# EAGLE board xio (EAGLE 9.1.0), part 1 of 4
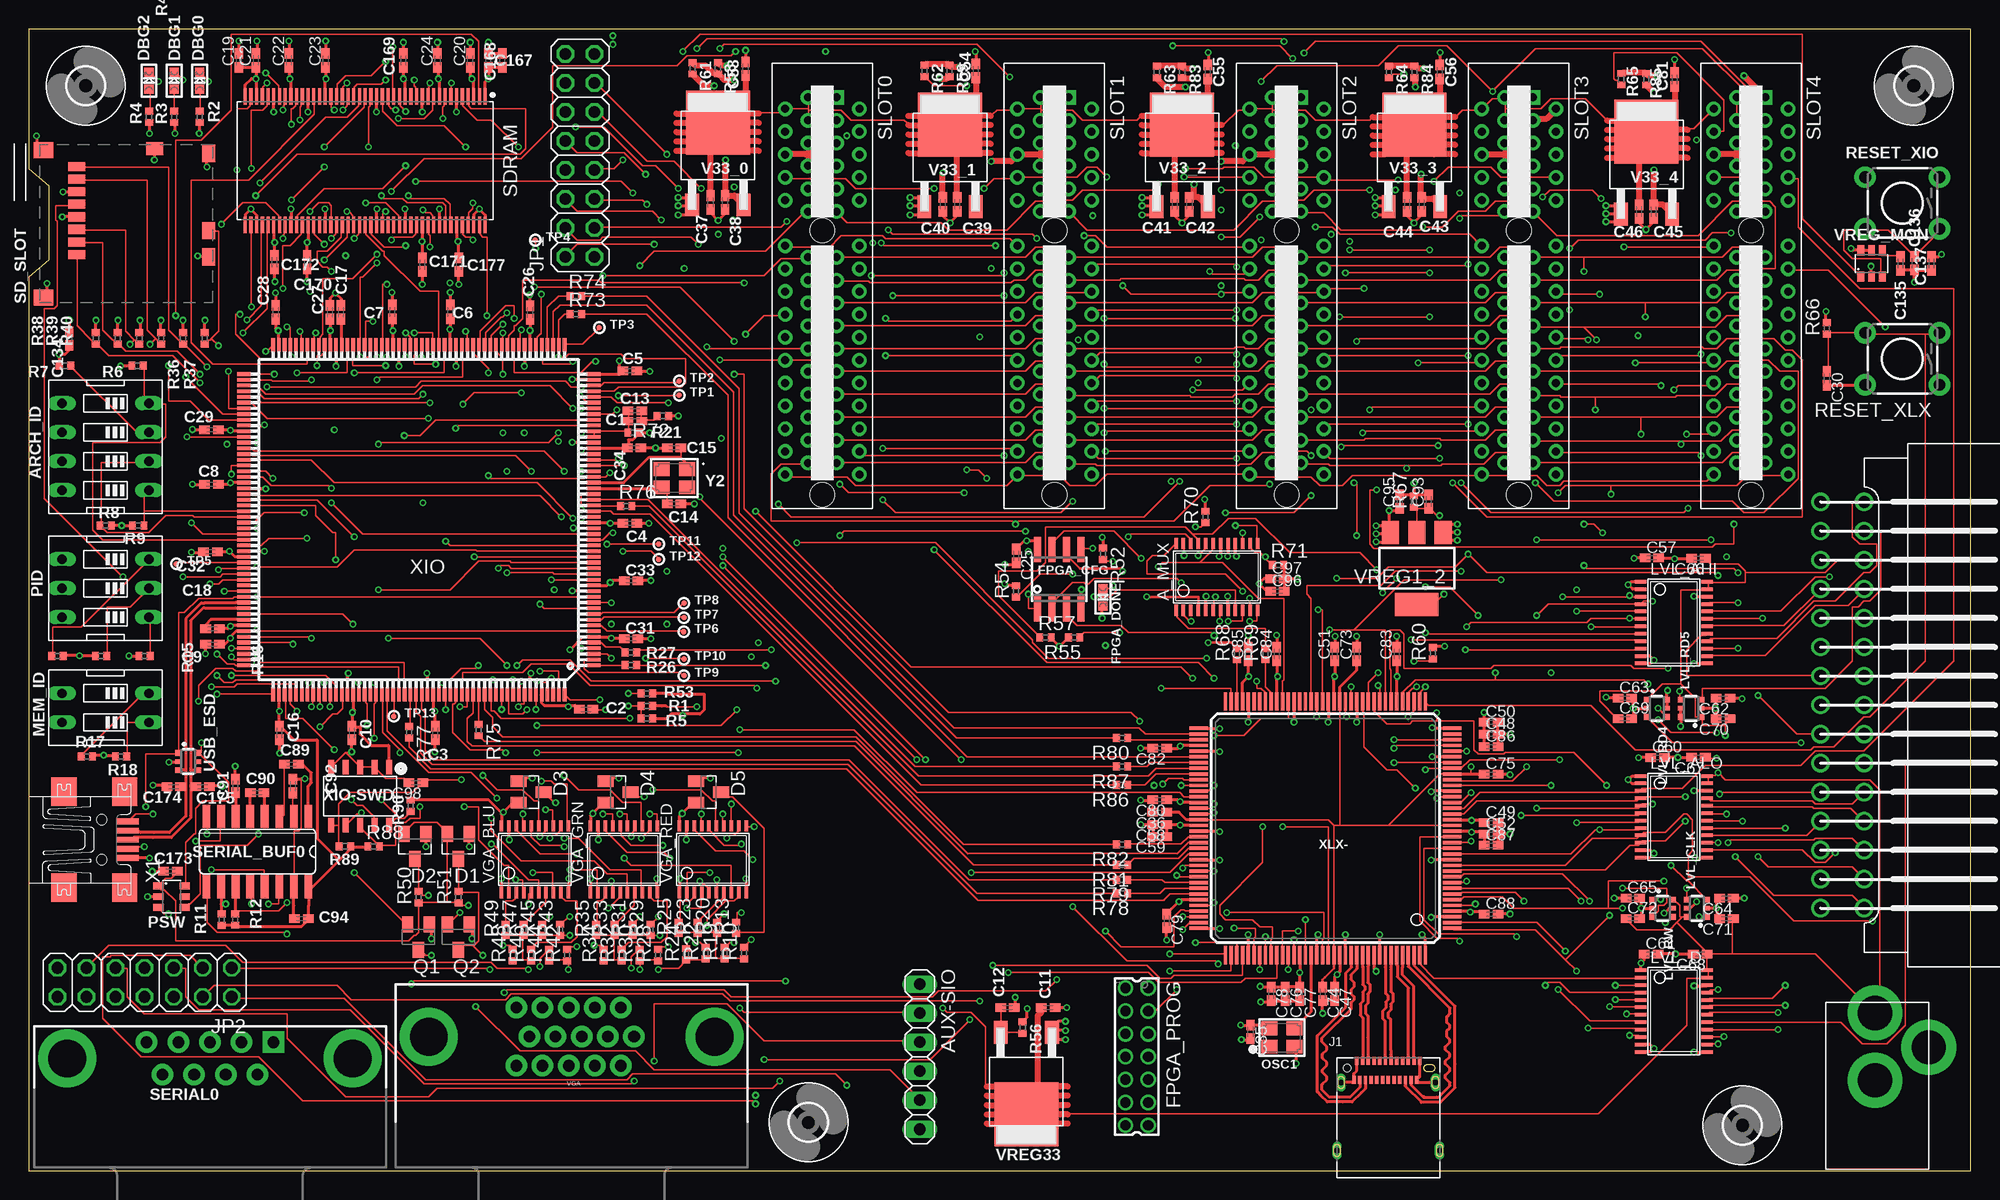
[diagram p19: board, top side]
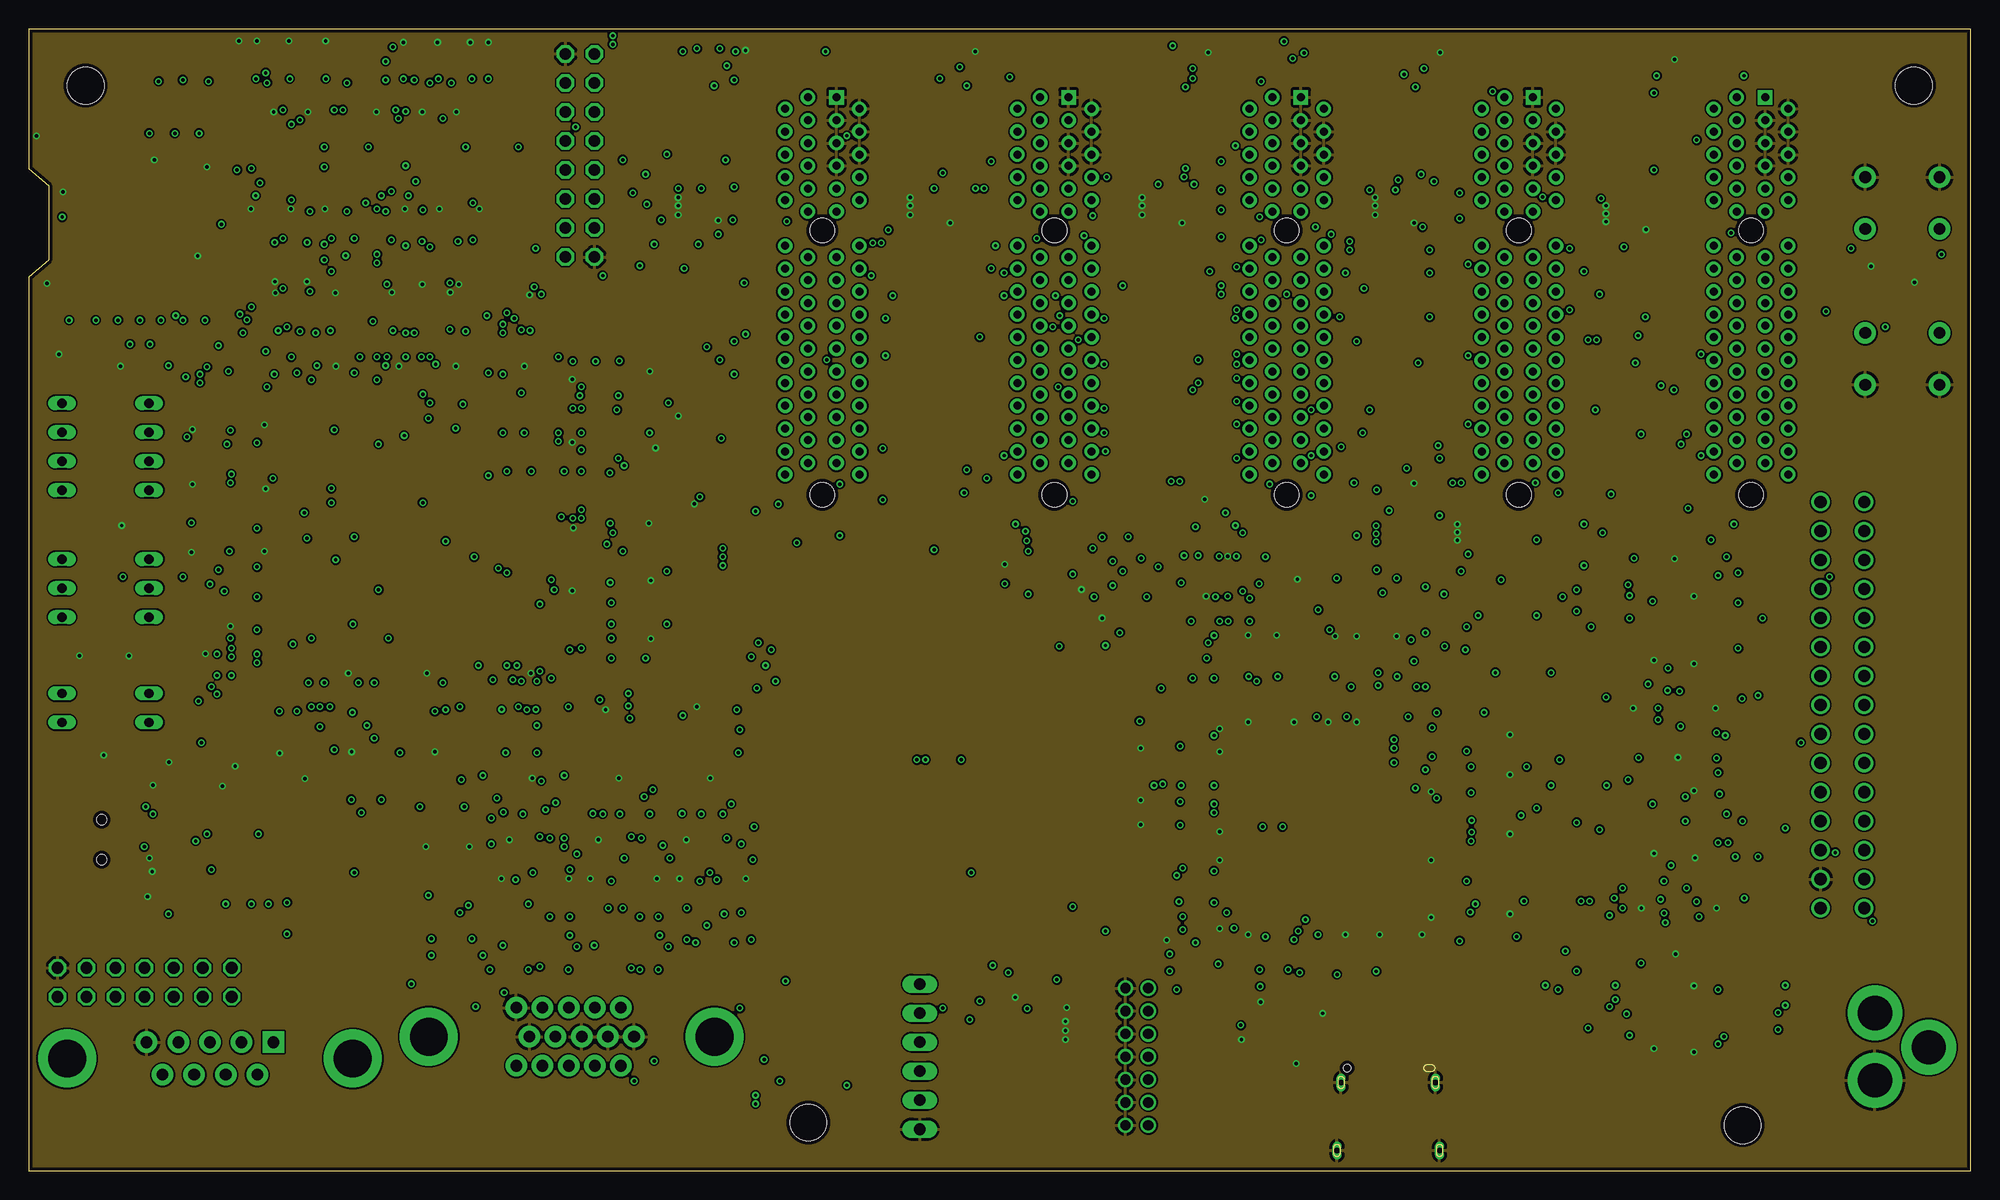
[diagram p20: board, inner layer Route2]
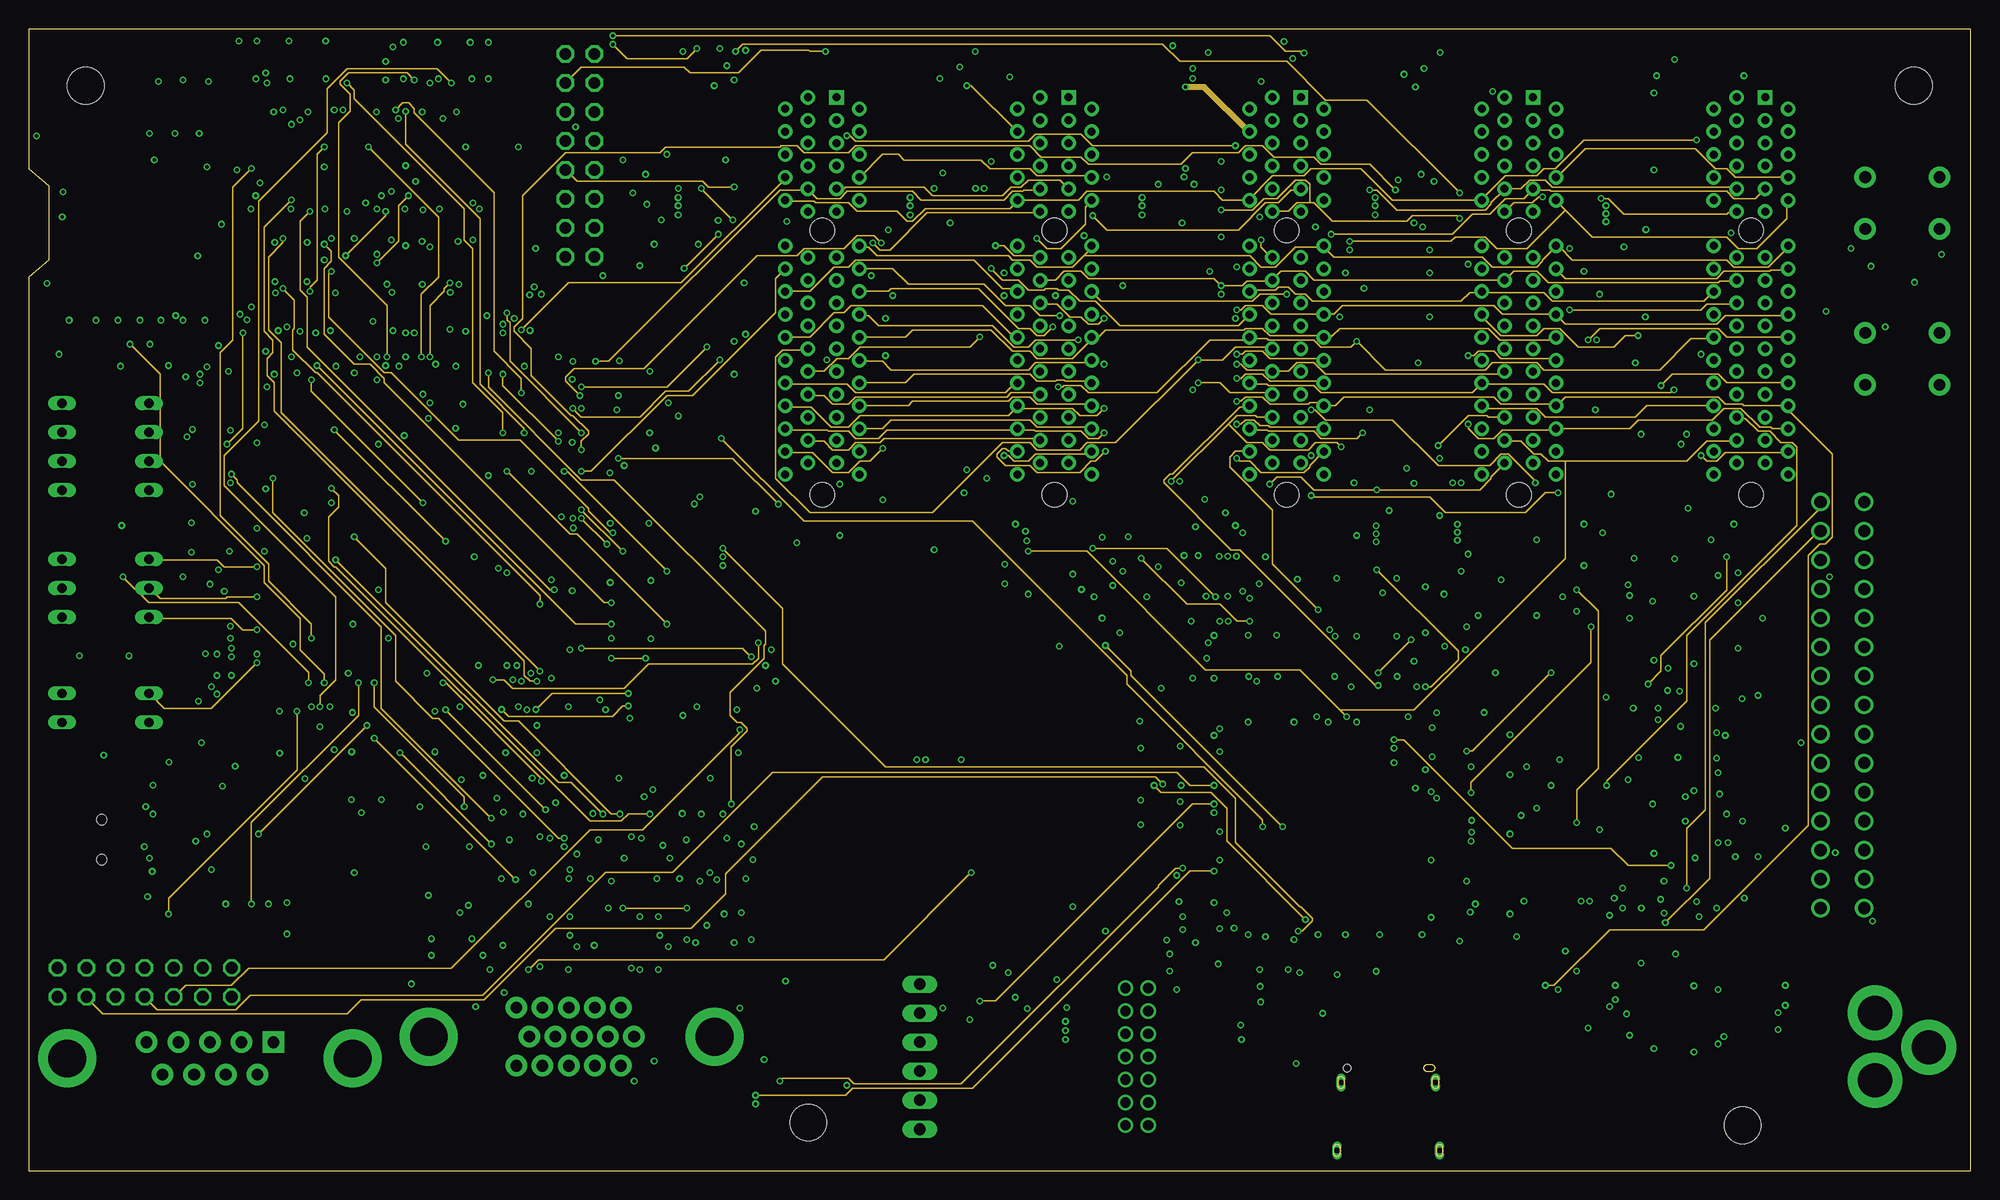
[diagram p21: board, inner layer Route3]
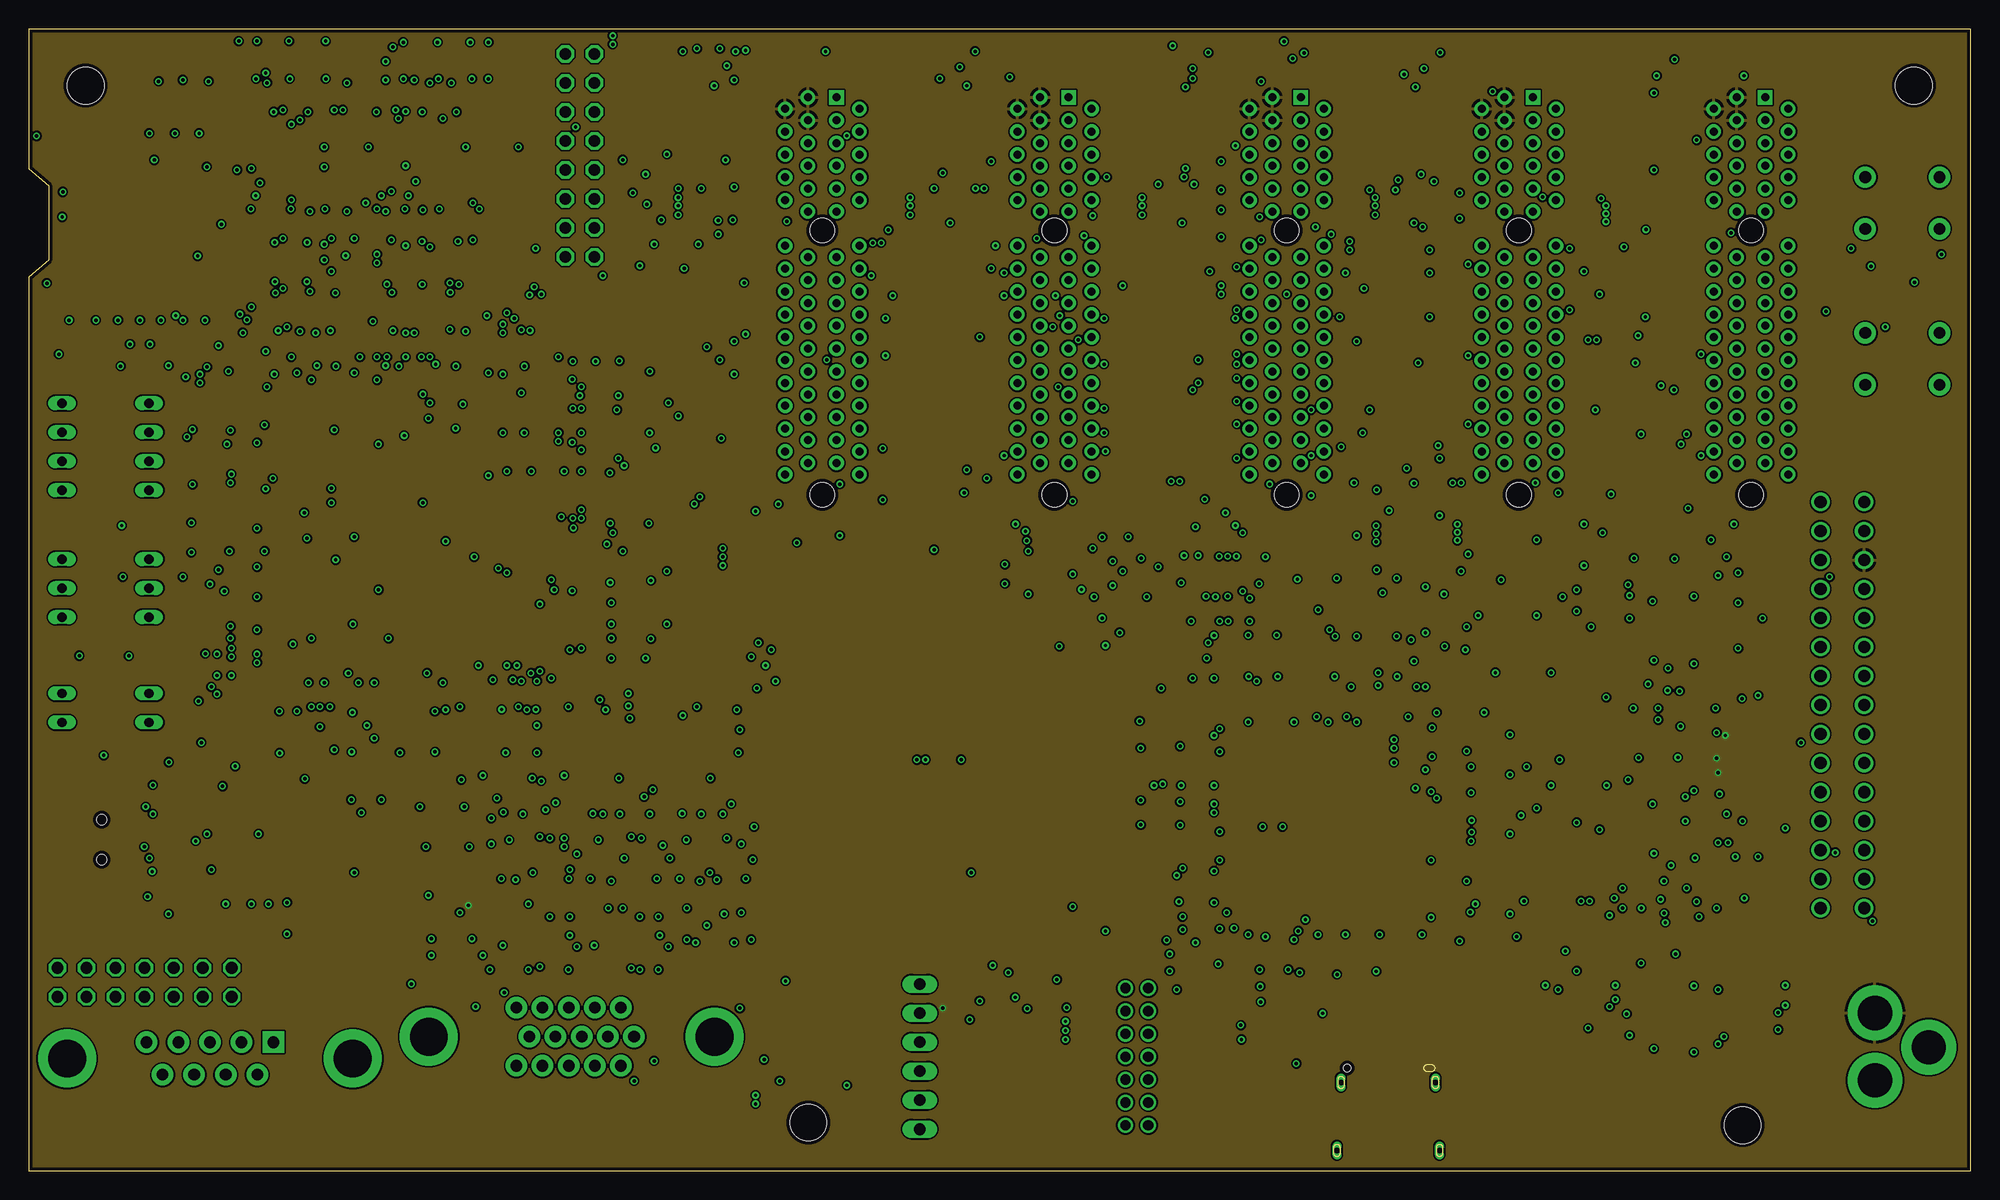
[diagram p22: board, inner layer Route14]
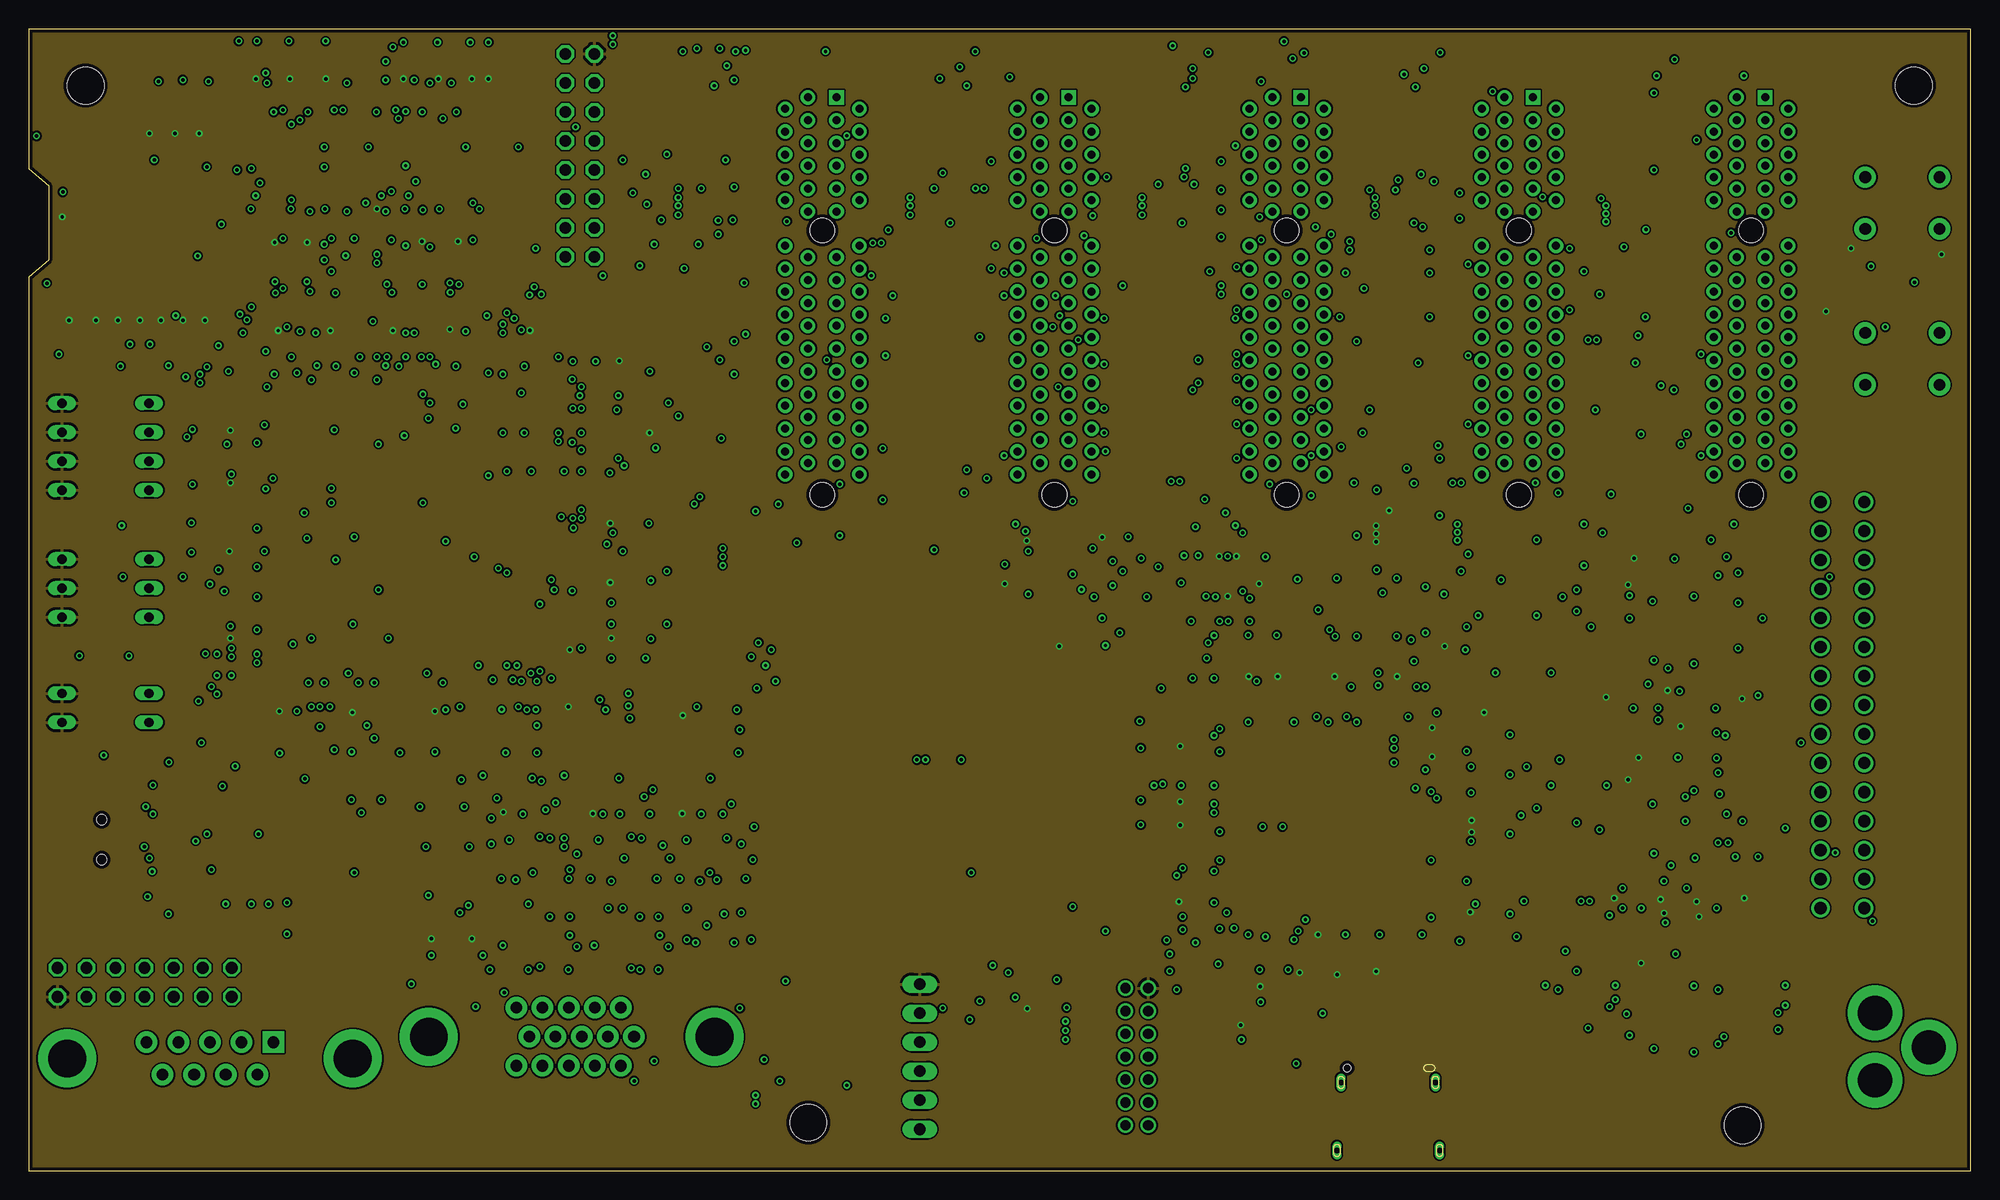
[diagram p23: board, inner layer Route15]
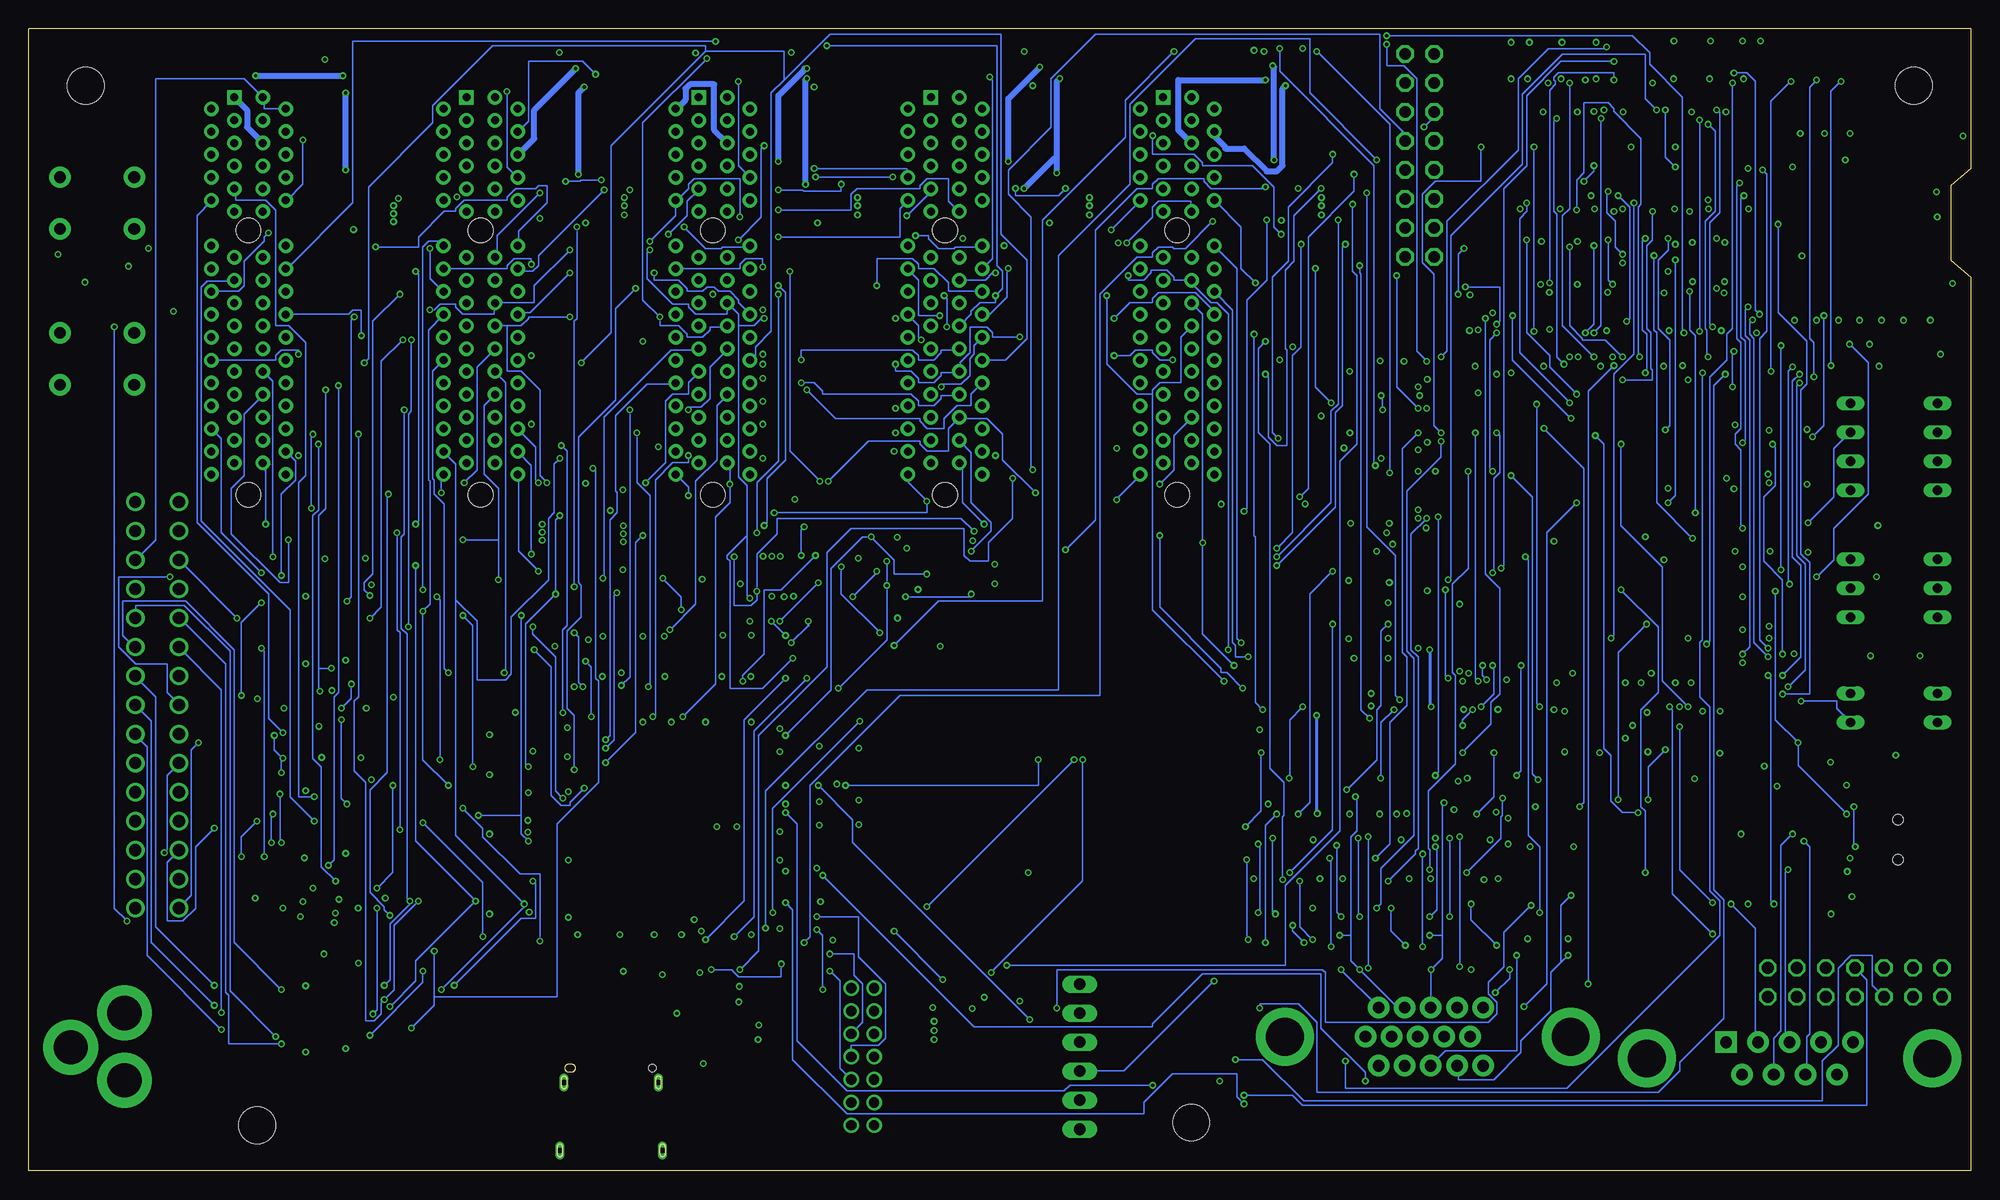
[diagram p24: board, bottom side, seen from below]

Size 170 x 100 mm. Coordinates in mm from the lower left corner, seen from the top.
Outline: 170,0 170,100 24,100 23,100 15,100 14,100 13,100 0,100 0,87.75 1.75,86.25 1.75,79.75 0,78.25 0,0 123.89,0 153.03,0 170,0
Copper layers (1+2*3+14*15+16): Top 0.035mm / dielectric 0.12mm / Route2 0.017mm / dielectric 0.5mm / Route3 0.017mm / dielectric 0.24mm / Route14 0.017mm / dielectric 0.5mm / Route15 0.017mm / dielectric 0.12mm / Bottom 0.035mm
Design rules "seed-4layer-6.6 *": minimum track width 6mil, minimum drill 0.3mm, track to track 6mil, track to pad 6mil, pad to pad 6mil, via to via 6mil, smd to smd 0mil, copper to edge 12mil, drill to drill 12mil, minimum pad ring 6mil, minimum via ring 5.5mil, stop-mask expansion 4mil, vias tented up to drill 25mil, thermal gap 10mil
Net classes: 1 Power: width 0.305 mm, drill 0.203 mm; 2 Slot-power: width 0.508 mm; 3 tx100: width 0.254 mm, clearance 0.457 mm; 4 usb90: width 0.254 mm, clearance 0.178 mm; 5 cclk50: width 0.203 mm; 6 3v3: width 0.254 mm

## Footprints (pad centres in the part's own frame; a part is rotated, then mirrored left to right if it is on the bottom)
TSSOP24 = smd 0.305 x 0.991: 1 -3.575,-2.918; 2 -2.925,-2.918; 3 -2.275,-2.918; 4 -1.625,-2.918; 5 -0.975,-2.918; 6 -0.325,-2.918; 7 0.325,-2.918; 8 0.975,-2.918; 9 1.625,-2.918; 10 2.275,-2.918; 11 2.925,-2.918; 12 3.575,-2.918; 13 3.575,2.918; 14 2.925,2.918; 15 2.275,2.918; 16 1.625,2.918; 17 0.975,2.918; 18 0.325,2.918; 19 -0.325,2.918; 20 -0.975,2.918; 21 -1.625,2.918; 22 -2.275,2.918; 23 -2.925,2.918; 24 -3.575,2.918
EDG-04 = drill 0.813 long: 1 -3.81,-3.81; 2 -1.27,-3.81; 3 1.27,-3.81; 4 3.81,-3.81; 5 3.81,3.81; 6 1.27,3.81; 7 -1.27,3.81; 8 -3.81,3.81
1X06 = drill 1.016 long: 1 -6.35,0; 2 -3.81,0; 3 -1.27,0; 4 1.27,0; 5 3.81,0; 6 6.35,0
C0402K = smd 0.925 x 0.74: 1 -0.6,0; 2 0.6,0
A8_CART = drill 1.067: P1 -17.78,6.35; P2 -15.24,6.35; P3 -12.7,6.35; P4 -10.16,6.35; P5 -7.62,6.35; P6 -5.08,6.35; P7 -2.54,6.35; P8 0,6.35; P9 2.54,6.35; P10 5.08,6.35; P11 7.62,6.35; P12 10.16,6.35; P13 12.7,6.35; P14 15.24,6.35; P15 17.78,6.35; PA -17.78,10.16; PB -15.24,10.16; PC -12.7,10.16; PD -10.16,10.16; PE -7.62,10.16; PF -5.08,10.16; PH -2.54,10.16; PJ 0,10.16; PK 2.54,10.16; PL 5.08,10.16; PM 7.62,10.16; PN 10.16,10.16; PP 12.7,10.16; PR 15.24,10.16; PS 17.78,10.16
SOT23 = smd 1 x 1.4: 1 -0.95,-1.1; 2 0.95,-1.1; 3 0,1.1
CHIPLED_0603 = smd 0.8 x 0.8: A 0,-0.75; C 0,0.75
SOIC8_150MIL = smd 0.6 x 2.2: 1 -1.905,-2.6; 2 -0.635,-2.6; 3 0.635,-2.6; 4 1.905,-2.6; 5 1.905,2.6; 6 0.635,2.6; 7 -0.635,2.6; 8 -1.905,2.6
332-14 = drill 0.9 pad 1.27: 1 -6,-1; 2 -6,1; 3 -4,-1; 4 -4,1; 5 -2,-1; 6 -2,1; 7 0,-1; 8 0,1; 9 2,-1; 10 2,1; 11 4,-1; 12 4,1; 13 6,-1; 14 6,1
3,2 = hole 3.2: 0,0
AMPHENOL_12401598E4#2A = smd 0.3 x 0.7: A1 -2.75,0.66; A2 -2.25,0.66; A3 -1.75,0.66; A4 -1.25,0.66; A5 -0.75,0.66; A6 -0.25,0.66; A7 0.25,0.66; A8 0.75,0.66; A9 1.25,0.66; A10 1.75,0.66; A11 2.25,0.66; A12 2.75,0.66; B1 2.5,-1.04; B2 2,-1.04; B3 1.5,-1.04; B4 1,-1.04; B5 0.5,-1.04; B6 0,-1.04; B7 -0.5,-1.04; B8 -1,-1.04; B9 -1.5,-1.04; B10 -2,-1.04; B11 -2.5,-1.04; B12 -3,-1.04 | drill 0.5 pad 0.8 long: SH1 -4.13,-1.25; SH2 -4.49,-7.2; SH3 4.49,-7.2; SH4 4.13,-1.25 | hole 0.65: -3.6,0
2X08 = drill 1.016 octagon: 1 -8.89,-1.27; 2 -8.89,1.27; 3 -6.35,-1.27; 4 -6.35,1.27; 5 -3.81,-1.27; 6 -3.81,1.27; 7 -1.27,-1.27; 8 -1.27,1.27; 9 1.27,-1.27; 10 1.27,1.27; 11 3.81,-1.27; 12 3.81,1.27; 13 6.35,-1.27; 14 6.35,1.27; 15 8.89,-1.27; 16 8.89,1.27
2X07 = drill 1.016 octagon: 1 -7.62,-1.27; 2 -7.62,1.27; 3 -5.08,-1.27; 4 -5.08,1.27; 5 -2.54,-1.27; 6 -2.54,1.27; 7 0,-1.27; 8 0,1.27; 9 2.54,-1.27; 10 2.54,1.27; 11 5.08,-1.27; 12 5.08,1.27; 13 7.62,-1.27; 14 7.62,1.27
SOT363 = smd 0.5 x 0.5: 1 -0.75,-0.9; 3 0.75,-0.9; 4 0.75,0.9; 6 -0.75,0.9 | smd 0.4 x 0.5: 2 0,-0.9; 5 0,0.9
EDG-02 = drill 0.813 long: 1 -1.27,-3.81; 2 1.27,-3.81; 3 1.27,3.81; 4 -1.27,3.81
OSC_3.2X2.5MM = smd 1.4 x 1.2: 1 -1.1,-0.8; 2 1.1,-0.8; 3 1.1,0.8; 4 -1.1,0.8
EDG-03 = drill 0.813 long: 1 -2.54,-3.81; 2 0,-3.81; 3 2.54,-3.81; 4 2.54,3.81; 5 0,3.81; 6 -2.54,3.81
PJ-102A = drill 3 pad 4.8: RING 0.1,-3.39; RING_SW -4.6,-6.29; TIP 0.1,-9.29
SOT23-6 = smd 0.6 x 0.9: 1 -0.95,-1.15; 2 0,-1.15; 3 0.95,-1.15; 4 0.95,1.15; 5 0,1.15; 6 -0.95,1.15
R0402 = smd 0.6 x 0.7: 1 -0.5,0; 2 0.5,0
TACTILE-PTH = drill 1.016 pad 1.88: 1 -3.251,2.261; 2 3.251,2.261; 3 -3.251,-2.261; 4 3.251,-2.261
5025700893 = smd 1.5 x 1.15: DTCT -0.6,-7.375; GND1 6.15,-7.375; GND3 -2.9,-7.375 | smd 1.4 x 1.7: GND0 6.45,7.1; GND2 -6.45,7.1 | smd 1.15 x 1.5: GND4 6.575,-2.65 | smd 0.8 x 1.5: P$1 -2.7,4.2; P$2 -1.6,4.2; P$3 -0.5,4.2; P$4 0.6,4.2; P$5 1.7,4.2; P$6 2.8,4.2; P$7 3.9,4.2; P$8 5,4.2
SOP50P1176X120-86 = smd 1.436 x 0.28: 1 -5.619,10.5; 2 -5.619,10; 3 -5.619,9.5; 4 -5.619,9; 5 -5.619,8.5; 6 -5.619,8; 7 -5.619,7.5; 8 -5.619,7; 9 -5.619,6.5; 10 -5.619,6; 11 -5.619,5.5; 12 -5.619,5; 13 -5.619,4.5; 14 -5.619,4; 15 -5.619,3.5; 16 -5.619,3; 17 -5.619,2.5; 18 -5.619,2; 19 -5.619,1.5; 20 -5.619,1; 21 -5.619,0.5; 22 -5.619,0; 23 -5.619,-0.5; 24 -5.619,-1; 25 -5.619,-1.5; 26 -5.619,-2; 27 -5.619,-2.5; 28 -5.619,-3; 29 -5.619,-3.5; 30 -5.619,-4; 31 -5.619,-4.5; 32 -5.619,-5; 33 -5.619,-5.5; 34 -5.619,-6; 35 -5.619,-6.5; 36 -5.619,-7; 37 -5.619,-7.5; 38 -5.619,-8; 39 -5.619,-8.5; 40 -5.619,-9; 41 -5.619,-9.5; 42 -5.619,-10; 43 -5.619,-10.5; 44 5.619,-10.5; 45 5.619,-10; 46 5.619,-9.5; 47 5.619,-9; 48 5.619,-8.5; 49 5.619,-8; 50 5.619,-7.5; 51 5.619,-7; 52 5.619,-6.5; 53 5.619,-6; 54 5.619,-5.5; 55 5.619,-5; 56 5.619,-4.5; 57 5.619,-4; 58 5.619,-3.5; 59 5.619,-3; 60 5.619,-2.5; 61 5.619,-2; 62 5.619,-1.5; 63 5.619,-1; 64 5.619,-0.5; 65 5.619,0; 66 5.619,0.5; 67 5.619,1; 68 5.619,1.5; 69 5.619,2; 70 5.619,2.5; 71 5.619,3; 72 5.619,3.5; 73 5.619,4; 74 5.619,4.5; 75 5.619,5; 76 5.619,5.5; 77 5.619,6; 78 5.619,6.5; 79 5.619,7; 80 5.619,7.5; 81 5.619,8; 82 5.619,8.5; 83 5.619,9; 84 5.619,9.5; 85 5.619,10; 86 5.619,10.5
DB9 = drill 1.016 pad 1.88 square: 1 -5.54,-1.42 | drill 1.016 pad 1.88: 2 -2.77,-1.42; 3 0,-1.42; 4 2.77,-1.42; 5 5.54,-1.42; 6 -4.15,1.42; 7 -1.38,1.42; 8 1.38,1.42; 9 4.15,1.42 | drill 3.302 pad 5.08: G1 -12.5,0; G2 12.5,0
SO16 = smd 0.66 x 2.032: 1 -4.445,-3.073; 2 -3.175,-3.073; 3 -1.905,-3.073; 4 -0.635,-3.073; 5 0.635,-3.073; 6 1.905,-3.073; 7 3.175,-3.073; 8 4.445,-3.073; 9 4.445,3.073; 10 3.175,3.073; 11 1.905,3.073; 12 0.635,3.073; 13 -0.635,3.073; 14 -1.905,3.073; 15 -3.175,3.073; 16 -4.445,3.073
PCI-E_64 = drill 0.7 pad 1.27 square: A1 -12.06,1.5 | drill 0.7 pad 1.27: A2 -11.06,3.5; A3 -10.06,1.5; A4 -9.06,3.5; A5 -8.06,1.5; A6 -7.06,3.5; A7 -6.06,1.5; A8 -5.06,3.5; A9 -4.06,1.5; A10 -3.06,3.5; A11 -2.06,1.5; A12 0.94,3.5; A13 1.94,1.5; A14 2.94,3.5; A15 3.94,1.5; A16 4.94,3.5; A17 5.94,1.5; A18 6.94,3.5; A19 7.94,1.5; A20 8.94,3.5; A21 9.94,1.5; A22 10.94,3.5; A23 11.94,1.5; A24 12.94,3.5; A25 13.94,1.5; A26 14.94,3.5; A27 15.94,1.5; A28 16.94,3.5; A29 17.94,1.5; A30 18.94,3.5; A31 19.94,1.5; A32 20.94,3.5; B1 -12.06,-1; B2 -11.06,-3; B3 -10.06,-1; B4 -9.06,-3; B5 -8.06,-1; B6 -7.06,-3; B7 -6.06,-1; B8 -5.06,-3; B9 -4.06,-1; B10 -3.06,-3; B11 -2.06,-1; B12 0.94,-3; B13 1.94,-1; B14 2.94,-3; B15 3.94,-1; B16 4.94,-3; B17 5.94,-1; B18 6.94,-3; B19 7.94,-1; B20 8.94,-3; B21 9.94,-1; B22 10.94,-3; B23 11.94,-1; B24 12.94,-3; B25 13.94,-1; B26 14.94,-3; B27 15.94,-1; B28 16.94,-3; B29 17.94,-1; B30 18.94,-3; B31 19.94,-1; B32 20.94,-3 | hole 2.15: -0.41,0.25; 22.74,0.25
TESTPOINT_ROUND_0.5MM = smd 0.5 x 0.5: P$1 0,0
TO252-3L = smd 5.6 x 5.6: P$1 0,0 | smd 1.2 x 2: P$2 -2.25,-7.2; P$3 2.25,-7.2
DB15 = drill 1.016 pad 1.88: 1 -4.32,-7.62; 2 -2.03,-7.62; 3 0.26,-7.62; 4 2.55,-7.62; 5 4.84,-7.62; 6 -5.46,-5.08; 7 -3.17,-5.08; 8 -0.88,-5.08; 9 1.41,-5.08; 10 3.7,-5.08; 11 -4.32,-2.54; 12 -2.03,-2.54; 13 0.26,-2.54; 14 2.55,-2.54; 15 4.84,-2.54 | drill 3.302 pad 5.08: G1 -12.5,-5.08; G2 12.5,-5.08
TSSOP20 = smd 0.305 x 0.991: 1 -2.925,-2.918; 2 -2.275,-2.918; 3 -1.625,-2.918; 4 -0.975,-2.918; 5 -0.325,-2.918; 6 0.325,-2.918; 7 0.975,-2.918; 8 1.625,-2.918; 9 2.275,-2.918; 10 2.925,-2.918; 11 2.925,2.918; 12 2.275,2.918; 13 1.625,2.918; 14 0.975,2.918; 15 0.325,2.918; 16 -0.325,2.918; 17 -0.975,2.918; 18 -1.625,2.918; 19 -2.275,2.918; 20 -2.925,2.918
SOT223 = smd 1.5 x 2: 1 -2.3,-3.15; 2 0,-3.15; 3 2.3,-3.15 | smd 3.8 x 2: 4 0,3.15
UX60-MB-5ST = smd 2 x 0.5: 1 2.25,1.6; 2 2.25,0.8; 3 2.25,0; 4 2.25,-0.8; 5 2.25,-1.6 | smd 2.2 x 2.5: M1 -3.3,-4.2; M2 -3.3,4.2; M3 2,4.2; M4 2,-4.2 | hole 0.9: 0,-1.75; 0,1.75
PQFP208 = smd 1.2 x 0.32: 1 -15.3,12.75; 2 -15.3,12.25; 3 -15.3,11.75; 4 -15.3,11.25; 5 -15.3,10.75; 6 -15.3,10.25; 7 -15.3,9.75; 8 -15.3,9.25; 9 -15.3,8.75; 10 -15.3,8.25; 11 -15.3,7.75; 12 -15.3,7.25; 13 -15.3,6.75; 14 -15.3,6.25; 15 -15.3,5.75; 16 -15.3,5.25; 17 -15.3,4.75; 18 -15.3,4.25; 19 -15.3,3.75; 20 -15.3,3.25; 21 -15.3,2.75; 22 -15.3,2.25; 23 -15.3,1.75; 24 -15.3,1.25; 25 -15.3,0.75; 26 -15.3,0.25; 27 -15.3,-0.25; 28 -15.3,-0.75; 29 -15.3,-1.25; 30 -15.3,-1.75; 31 -15.3,-2.25; 32 -15.3,-2.75; 33 -15.3,-3.25; 34 -15.3,-3.75; 35 -15.3,-4.25; 36 -15.3,-4.75; 37 -15.3,-5.25; 38 -15.3,-5.75; 39 -15.3,-6.25; 40 -15.3,-6.75; 41 -15.3,-7.25; 42 -15.3,-7.75; 43 -15.3,-8.25; 44 -15.3,-8.75; 45 -15.3,-9.25; 46 -15.3,-9.75; 47 -15.3,-10.25; 48 -15.3,-10.75; 49 -15.3,-11.25; 50 -15.3,-11.75; 51 -15.3,-12.25; 52 -15.3,-12.75; 105 15.3,-12.75; 106 15.3,-12.25; 107 15.3,-11.75; 108 15.3,-11.25; 109 15.3,-10.75; 110 15.3,-10.25; 111 15.3,-9.75; 112 15.3,-9.25; 113 15.3,-8.75; 114 15.3,-8.25; 115 15.3,-7.75; 116 15.3,-7.25; 117 15.3,-6.75; 118 15.3,-6.25; 119 15.3,-5.75; 120 15.3,-5.25; 121 15.3,-4.75; 122 15.3,-4.25; 123 15.3,-3.75; 124 15.3,-3.25; 125 15.3,-2.75; 126 15.3,-2.25; 127 15.3,-1.75; 128 15.3,-1.25; 129 15.3,-0.75; 130 15.3,-0.25; 131 15.3,0.25; 132 15.3,0.75; 133 15.3,1.25; 134 15.3,1.75; 135 15.3,2.25; 136 15.3,2.75; 137 15.3,3.25; 138 15.3,3.75; 139 15.3,4.25; 140 15.3,4.75; 141 15.3,5.25; 142 15.3,5.75; 143 15.3,6.25; 144 15.3,6.75; 145 15.3,7.25; 146 15.3,7.75; 147 15.3,8.25; 148 15.3,8.75; 149 15.3,9.25; 150 15.3,9.75; 151 15.3,10.25; 152 15.3,10.75; 153 15.3,11.25; 154 15.3,11.75; 155 15.3,12.25; 156 15.3,12.75 | smd 0.32 x 1.2: 53 -12.75,-15.3; 54 -12.25,-15.3; 55 -11.75,-15.3; 56 -11.25,-15.3; 57 -10.75,-15.3; 58 -10.25,-15.3; 59 -9.75,-15.3; 60 -9.25,-15.3; 61 -8.75,-15.3; 62 -8.25,-15.3; 63 -7.75,-15.3; 64 -7.25,-15.3; 65 -6.75,-15.3; 66 -6.25,-15.3; 67 -5.75,-15.3; 68 -5.25,-15.3; 69 -4.75,-15.3; 70 -4.25,-15.3; 71 -3.75,-15.3; 72 -3.25,-15.3; 73 -2.75,-15.3; 74 -2.25,-15.3; 75 -1.75,-15.3; 76 -1.25,-15.3; 77 -0.75,-15.3; 78 -0.25,-15.3; 79 0.25,-15.3; 80 0.75,-15.3; 81 1.25,-15.3; 82 1.75,-15.3; 83 2.25,-15.3; 84 2.75,-15.3; 85 3.25,-15.3; 86 3.75,-15.3; 87 4.25,-15.3; 88 4.75,-15.3; 89 5.25,-15.3; 90 5.75,-15.3; 91 6.25,-15.3; 92 6.75,-15.3; 93 7.25,-15.3; 94 7.75,-15.3; 95 8.25,-15.3; 96 8.75,-15.3; 97 9.25,-15.3; 98 9.75,-15.3; 99 10.25,-15.3; 100 10.75,-15.3; 101 11.25,-15.3; 102 11.75,-15.3; 103 12.25,-15.3; 104 12.75,-15.3; 157 12.75,15.3; 158 12.25,15.3; 159 11.75,15.3; 160 11.25,15.3; 161 10.75,15.3; 162 10.25,15.3; 163 9.75,15.3; 164 9.25,15.3; 165 8.75,15.3; 166 8.25,15.3; 167 7.75,15.3; 168 7.25,15.3; 169 6.75,15.3; 170 6.25,15.3; 171 5.75,15.3; 172 5.25,15.3; 173 4.75,15.3; 174 4.25,15.3; 175 3.75,15.3; 176 3.25,15.3; 177 2.75,15.3; 178 2.25,15.3; 179 1.75,15.3; 180 1.25,15.3; 181 0.75,15.3; 182 0.25,15.3; 183 -0.25,15.3; 184 -0.75,15.3; 185 -1.25,15.3; 186 -1.75,15.3; 187 -2.25,15.3; 188 -2.75,15.3; 189 -3.25,15.3; 190 -3.75,15.3; 191 -4.25,15.3; 192 -4.75,15.3; 193 -5.25,15.3; 194 -5.75,15.3; 195 -6.25,15.3; 196 -6.75,15.3; 197 -7.25,15.3; 198 -7.75,15.3; 199 -8.25,15.3; 200 -8.75,15.3; 201 -9.25,15.3; 202 -9.75,15.3; 203 -10.25,15.3; 204 -10.75,15.3; 205 -11.25,15.3; 206 -11.75,15.3; 207 -12.25,15.3; 208 -12.75,15.3
SWD_DEBUG = smd 0.508 x 1.27: P1 -2.54,-2.54; P2 -2.54,2.54; P3 -1.27,-2.54; P4 -1.27,2.54; P5 0,-2.54; P6 0,2.54; P7 1.27,-2.54; P8 1.27,2.54; P9 2.54,-2.54; P10 2.54,2.54
TQ144 = smd 1.6 x 0.3: P1 -11.1,8.75; P2 -11.1,8.25; P3 -11.1,7.75; P4 -11.1,7.25; P5 -11.1,6.75; P6 -11.1,6.25; P7 -11.1,5.75; P8 -11.1,5.25; P9 -11.1,4.75; P10 -11.1,4.25; P11 -11.1,3.75; P12 -11.1,3.25; P13 -11.1,2.75; P14 -11.1,2.25; P15 -11.1,1.75; P16 -11.1,1.25; P17 -11.1,0.75; P18 -11.1,0.25; P19 -11.1,-0.25; P20 -11.1,-0.75; P21 -11.1,-1.25; P22 -11.1,-1.75; P23 -11.1,-2.25; P24 -11.1,-2.75; P25 -11.1,-3.25; P26 -11.1,-3.75; P27 -11.1,-4.25; P28 -11.1,-4.75; P29 -11.1,-5.25; P30 -11.1,-5.75; P31 -11.1,-6.25; P32 -11.1,-6.75; P33 -11.1,-7.25; P34 -11.1,-7.75; P35 -11.1,-8.25; P36 -11.1,-8.75; P73 11.1,-8.75; P74 11.1,-8.25; P75 11.1,-7.75; P76 11.1,-7.25; P77 11.1,-6.75; P78 11.1,-6.25; P79 11.1,-5.75; P80 11.1,-5.25; P81 11.1,-4.75; P82 11.1,-4.25; P83 11.1,-3.75; P84 11.1,-3.25; P85 11.1,-2.75; P86 11.1,-2.25; P87 11.1,-1.75; P88 11.1,-1.25; P89 11.1,-0.75; P90 11.1,-0.25; P91 11.1,0.25; P92 11.1,0.75; P93 11.1,1.25; P94 11.1,1.75; P95 11.1,2.25; P96 11.1,2.75; P97 11.1,3.25; P98 11.1,3.75; P99 11.1,4.25; P100 11.1,4.75; P101 11.1,5.25; P102 11.1,5.75; P103 11.1,6.25; P104 11.1,6.75; P105 11.1,7.25; P106 11.1,7.75; P107 11.1,8.25; P108 11.1,8.75 | smd 0.3 x 1.6: P37 -8.75,-11.1; P38 -8.25,-11.1; P39 -7.75,-11.1; P40 -7.25,-11.1; P41 -6.75,-11.1; P42 -6.25,-11.1; P43 -5.75,-11.1; P44 -5.25,-11.1; P45 -4.75,-11.1; P46 -4.25,-11.1; P47 -3.75,-11.1; P48 -3.25,-11.1; P49 -2.75,-11.1; P50 -2.25,-11.1; P51 -1.75,-11.1; P52 -1.25,-11.1; P53 -0.75,-11.1; P54 -0.25,-11.1; P55 0.25,-11.1; P56 0.75,-11.1; P57 1.25,-11.1; P58 1.75,-11.1; P59 2.25,-11.1; P60 2.75,-11.1; P61 3.25,-11.1; P62 3.75,-11.1; P63 4.25,-11.1; P64 4.75,-11.1; P65 5.25,-11.1; P66 5.75,-11.1; P67 6.25,-11.1; P68 6.75,-11.1; P69 7.25,-11.1; P70 7.75,-11.1; P71 8.25,-11.1; P72 8.75,-11.1; P109 8.75,11.1; P110 8.25,11.1; P111 7.75,11.1; P112 7.25,11.1; P113 6.75,11.1; P114 6.25,11.1; P115 5.75,11.1; P116 5.25,11.1; P117 4.75,11.1; P118 4.25,11.1; P119 3.75,11.1; P120 3.25,11.1; P121 2.75,11.1; P122 2.25,11.1; P123 1.75,11.1; P124 1.25,11.1; P125 0.75,11.1; P126 0.25,11.1; P127 -0.25,11.1; P128 -0.75,11.1; P129 -1.25,11.1; P130 -1.75,11.1; P131 -2.25,11.1; P132 -2.75,11.1; P133 -3.25,11.1; P134 -3.75,11.1; P135 -4.25,11.1; P136 -4.75,11.1; P137 -5.25,11.1; P138 -5.75,11.1; P139 -6.25,11.1; P140 -6.75,11.1; P141 -7.25,11.1; P142 -7.75,11.1; P143 -8.25,11.1; P144 -8.75,11.1
CRYSTAL_3.2X2.5 = smd 1.4 x 1.2: 1 -1.1,-0.8; 2 1.1,0.8; GND1 -1.1,0.8; GND2 1.1,-0.8

## Placement (x,y rotation side)
A_MUX  TS3A27518EPWR  [TSSOP24]  104,52 0 top
ARCH_ID  209-4MS  [EDG-04]  6.74,63.39 90 top
AUX-SIO  [1X06]  78,10 270 top
C1  10uF  [C0402K]  53.06,65.64 0 top
C2  0.1uF  [C0402K]  48.8,40.4 0 top
C3  0.1uF  [C0402K]  35.6,38.34 270 top
C4  0.1uF  [C0402K]  52.63,56.69 0 top
C5  0.1uF  [C0402K]  52.63,70.03 0 top
C6  0.1uF  [C0402K]  36.91,75.21 90 top
C7  0.1uF  [C0402K]  31.83,75.21 90 top
C8  0.1uF  [C0402K]  16,60.12 180 top
C9  0.1uF  [C0402K]  16.1,46.1 180 top
C10  0.1uF  [C0402K]  28.3,38.34 270 top
C11  10uF  [C0402K]  89.25,14.29 0 top
C12  10uF  [C0402K]  85.67,14.29 0 top
C13  0.1uF  [C0402K]  53.06,66.53 0 top
C14  12pF  [C0402K]  56.5,58.39 0 top
C15  12pF  [C0402K]  56.5,63.3 180 top
C16  0.1uF  [C0402K]  21.95,38.34 270 top
C17  2.2uF  [C0402K]  27.34,75.17 90 top
C18  2.2uF  [C0402K]  16.1,47.47 0 top
C19  0.1uF  [C0402K]  18.4,97.2 90 top
C20  0.1uF  [C0402K]  38.65,97.2 90 top
C21  0.1uF  [C0402K]  19.9,97.2 90 top
C22  0.1uF  [C0402K]  22.8,97.2 90 top
C23  0.1uF  [C0402K]  26,97.2 90 top
C24  0.1uF  [C0402K]  35.8,97.2 90 top
C25  0.1uF  [C0402K]  86.44,53.84 270 top
C26  0.1uF  [C0402K]  43.9,75.13 90 top
C27  0.1uF  [C0402K]  26.39,75.17 90 top
C28  0.1uF  [C0402K]  21.63,75.17 90 top
C29  0.1uF  [C0402K]  16,64.89 180 top
C30  0.1uF  [C0402K]  157.38,69.39 270 top
C31  0.1uF  [C0402K]  52.74,46.59 0 top
C32  0.1uF  [C0402K]  15.91,54.21 180 top
C33  0.1uF  [C0402K]  52.74,51.67 0 top
C34  10uF  [C0402K]  53,63.3 0 top
C35  0.01uF  [C0402K]  106.94,12.18 270 top
C36  4.7uF  [C0402K]  99,31.4 180 top
C37  10uF  [C0402K]  59.69,84.77 270 top
C38  10uF  [C0402K]  60.96,84.77 270 top
C39  10uF  [C0402K]  81.28,84.61 270 top
C40  10uF  [C0402K]  80.01,84.61 270 top
C41  10uF  [C0402K]  100.33,84.61 270 top
C42  10uF  [C0402K]  101.6,84.61 270 top
C43  10uF  [C0402K]  120.65,84.61 270 top
C44  10uF  [C0402K]  121.92,84.61 270 top
C45  10uF  [C0402K]  140.97,83.98 270 top
C46  10uF  [C0402K]  142.24,83.98 270 top
C47  4.7uF  [C0402K]  114.33,15.51 270 top
C48  4.7uF  [C0402K]  128,38.25 0 top
C49  4.7uF  [C0402K]  128,30.5 0 top
C50  4.7uF  [C0402K]  128,39.3 0 top
C51  4.7uF  [C0402K]  114.33,45.26 90 top
C52  0.47uF  [C0402K]  128,29.5 0 top
C53  0.1uF  [C0402K]  62.75,96.48 90 top
C54  0.1uF  [C0402K]  82.9,96.3 90 top
C55  0.1uF  [C0402K]  103.19,96.2 90 top
C56  0.1uF  [C0402K]  123.51,96.2 90 top
C57  0.1uF  [C0402K]  142.07,53.66 0 top
C58  4.7uF  [C0402K]  98.99,30.33 180 top
C59  4.7uF  [C0402K]  98.99,29.28 180 top
C60  0.1uF  [C0402K]  142.57,36.2 0 top
C61  0.1uF  [C0402K]  142,19 0 top
C62  0.1uF  [C0402K]  148.3,41.4 180 top
C63  0.1uF  [C0402K]  139.7,41.4 0 top
C64  0.1uF  [C0402K]  148.6,23.9 180 top
C65  0.1uF  [C0402K]  140.4,23.9 0 top
C66  0.1uF  [C0402K]  146.15,53.64 180 top
C67  0.1uF  [C0402K]  146.15,36.2 180 top
C68  0.1uF  [C0402K]  146.3,19 180 top
C69  0.1uF  [C0402K]  139.7,39.6 0 top
C70  0.1uF  [C0402K]  148.3,39.6 180 top
C71  0.1uF  [C0402K]  148.6,22.1 180 top
C72  0.1uF  [C0402K]  140.4,22.1 0 top
C73  0.47uF  [C0402K]  116.25,45.25 90 top
C74  4.7uF  [C0402K]  113.25,15.5 270 top
C75  4.7uF  [C0402K]  128,34.75 0 top
C76  0.47uF  [C0402K]  110,15.5 270 top
C77  4.7uF  [C0402K]  111.25,15.5 270 top
C78  0.47uF  [C0402K]  108.75,15.5 270 top
C79  0.47uF  [C0402K]  99.6,21.9 270 top
C80  4.7uF  [C0402K]  99,32.5 180 top
C81  0.1uF  [C0402K]  144.07,95.53 90 top
C82  0.47uF  [C0402K]  99,37 180 top
C83  0.47uF  [C0402K]  119.75,45.25 90 top
C84  4.7uF  [C0402K]  109.25,45.25 90 top
C85  0.47uF  [C0402K]  106.75,45.25 90 top
C86  0.47uF  [C0402K]  128,37.15 0 top
C87  4.7uF  [C0402K]  128,28.5 0 top
C88  0.47uF  [C0402K]  128,22.5 0 top
C89  0.1uF  [C0402K]  23,35.6 0 top
C90  0.1uF  [C0402K]  20,33.1 0 top
C91  0.1uF  [C0402K]  18.1,33.7 90 top
C92  0.1uF  [C0402K]  23.12,33.69 90 top
C93  10uF  [C0402K]  122.55,58.6 90 top
C94  0.1uF  [C0402K]  23.88,22.08 0 top
C95  0.1uF  [C0402K]  120,58.6 90 top
C96  0.1uF  [C0402K]  109.3,50.75 0 top
C97  1uF  [C0402K]  109.3,51.85 0 top
C98  0.1uF  [C0402K]  33.9,34 180 top
C134  0.1uF  [C0402K]  3.56,72.86 90 top
C135  120pF  [C0402K]  163.84,79.44 270 top
C136  10nF  [C0402K]  165.07,79.47 270 top
C137  0.1uF  [C0402K]  166.56,79.44 270 top
C167  0.1uF  [C0402K]  40.25,97.2 90 top
C168  0.1uF  [C0402K]  41.48,97.21 90 top
C169  0.1uF  [C0402K]  32.8,97.2 90 top
C170  0.1uF  [C0402K]  24.39,79.55 270 top
C171  0.1uF  [C0402K]  34.48,79.34 270 top
C172  0.1uF  [C0402K]  21.53,79.55 270 top
C173  0.1uF  [C0402K]  12.42,26.24 180 top
C174  0.47pF  [C0402K]  12.7,33.66 180 top
C175  0.47pF  [C0402K]  15.24,33.66 0 top
C177  4.7uF  [C0402K]  37.66,79.34 270 top
CARTRIDGE  A8_CART  [A8_CART]  167,40.78 90 top
D1  BAT54S  [SOT23]  37.62,28.41 180 top
D2  BAT54S  [SOT23]  33.81,28.41 180 top
D3  BAT54S  [SOT23]  43.97,33.17 270 top
D4  BAT54S  [SOT23]  51.59,33.17 270 top
D5  BAT54S  [SOT23]  59.53,33.17 270 top
DBG0  LTST-C191KFKT  [CHIPLED_0603]  14.98,95.44 0 top
DBG1  LTST-C191KFKT  [CHIPLED_0603]  12.76,95.44 0 top
DBG2  LTST-C191KFKT  [CHIPLED_0603]  10.54,95.44 0 top
FPGA_CFG  W25Q80DVSNIG  [SOIC8_150MIL]  90.21,51.8 0 top
FPGA_DONE  LTST-C191KFKT  [CHIPLED_0603]  94.02,50.22 180 top
FPGA_PROG  XILINX-JTAG  [332-14]  97,10 270 top
H1  MOUNT-HOLE3.2  [3,2]  68.25,4.25 0 top
H2  MOUNT-HOLE3.2  [3,2]  150,4 0 top
H4  MOUNT-HOLE3.2  [3,2]  5,95 0 top
H5  MOUNT-HOLE3.2  [3,2]  165,95 0 top
J1  12401598E4#2A  [AMPHENOL_12401598E4#2A]  119,9 0 top
JP1  [2X08]  48.26,88.9 90 top
JP2  [2X07]  10.16,16.51 180 top
LVL_AHI  SN74LVC8T245  [TSSOP24]  144,48 270 top
LVL_ALO  SN74LVC8T245  [TSSOP24]  144,31 270 top
LVL_CLK  74LVCH1T45GW,125  [SOT363]  146,23 90 top
LVL_D  SN74LVC8T245  [TSSOP24]  144,14 270 top
LVL_RD4  74LVCH1T45GW,125  [SOT363]  142.5,40.5 270 top
LVL_RD5  74LVCH1T45GW,125  [SOT363]  145.5,40.5 90 top
LVL_RW  74LVCH1T45GW,125  [SOT363]  143,23 270 top
MEM_ID  209-2MS  [EDG-02]  6.74,40.53 90 top
OSC1  ASEMB-50.000MHZ-LC-T  [OSC_3.2X2.5MM]  109.69,11.68 0 top
PID  209-3MS  [EDG-03]  6.74,51.01 90 top
PJ-102AH  PJ-102AH  [PJ-102A]  161.7,4.54 180 top
PSW  NCP380  [SOT23-6]  12.52,24.02 270 top
Q1  BSS138  [SOT23]  34.13,20.48 180 top
Q2  BSS138  [SOT23]  37.62,20.48 180 top
R1  0R  [R0402]  54.1,40.7 0 top
R2  1K  [R0402]  14.98,92.28 90 top
R3  1K  [R0402]  12.76,92.28 90 top
R4  1K  [R0402]  10.54,92.28 90 top
R5  0R  [R0402]  54.1,39.6 180 top
R6  47K  [R0402]  9.55,70.48 180 top
R7  47K  [R0402]  3.2,70.48 180 top
R8  47K  [R0402]  6.75,56.49 0 top
R9  47K  [R0402]  9.6,56.51 180 top
R10  71.5K  [R0402]  62.61,19.06 90 top
R11  1K  [R0402]  18.09,22.02 90 top
R12  1K  [R0402]  16.91,21.99 90 top
R13  35.7K  [R0402]  61.93,21.28 90 top
R14  47K  [R0402]  2.54,45.09 0 top
R15  47K  [R0402]  6.35,45.09 180 top
R16  47K  [R0402]  10.16,45.09 180 top
R17  47K  [R0402]  5.1,36.3 0 top
R18  47K  [R0402]  8.1,36.3 180 top
R19  17.8K  [R0402]  60.93,19.06 90 top
R20  8.66K  [R0402]  60.24,21.28 90 top
R21  33R  [R0402]  52.95,64.63 0 top
R22  4.37K  [R0402]  59.24,19.06 90 top
R23  2.18K  [R0402]  58.56,21.28 90 top
R24  1.05K  [R0402]  57.56,18.96 90 top
R25  549R  [R0402]  56.88,21.28 90 top
R26  33R  [R0402]  52.7,44.3 180 top
R27  33R  [R0402]  52.7,45.4 180 top
R28  71.5K  [R0402]  55.09,18.89 90 top
R29  35.7K  [R0402]  54.45,21.11 90 top
R30  17.8K  [R0402]  53.5,18.89 90 top
R31  8.66K  [R0402]  52.86,21.11 90 top
R32  4.37K  [R0402]  51.91,18.89 90 top
R33  2.18K  [R0402]  51.27,21.11 90 top
R34  1.05K  [R0402]  50.32,18.89 90 top
R35  549R  [R0402]  49.69,21.11 90 top
R36  47K  [R0402]  11.61,72.89 90 top
R37  47K  [R0402]  13.52,72.89 90 top
R38  47K  [R0402]  5.89,72.89 90 top
R39  47K  [R0402]  7.8,72.89 90 top
R40  47K  [R0402]  9.71,72.89 90 top
R41  47K  [R0402]  15.42,72.89 90 top
R42  71.5K  [R0402]  47.15,18.89 90 top
R43  35.7K  [R0402]  46.51,21.11 90 top
R44  17.8K  [R0402]  45.56,18.89 90 top
R45  8.66K  [R0402]  44.92,21.11 90 top
R46  4.37K  [R0402]  43.97,18.89 90 top
R47  2.18K  [R0402]  43.34,21.11 90 top
R48  1.05K  [R0402]  42.38,18.89 90 top
R49  549R  [R0402]  41.75,21.11 90 top
R50  1K  [R0402]  34.13,23.97 90 top
R51  1K  [R0402]  37.62,23.97 90 top
R52  680R  [R0402]  94.02,54.02 270 top
R53  0R  [R0402]  54.1,41.8 180 top
R54  2.4K  [R0402]  86.44,50.73 90 top
R55  2.4K  [R0402]  91.5,46.7 180 top
R56  0R  [R0402]  87.01,12.56 270 top
R57  2.4K  [R0402]  89,46.7 0 top
R58  0R  [R0402]  60.33,96.52 90 top
R59  0R  [R0402]  80.6,96.3 270 top
R60  4.7K  [R0402]  122.92,45.31 90 top
R61  10K  [R0402]  58.1,96.52 270 top
R62  10K  [R0402]  78.4,96.3 270 top
R63  10K  [R0402]  98.74,96.2 270 top
R64  10K  [R0402]  119.06,96.2 270 top
R65  10K  [R0402]  139.38,95.57 270 top
R66  4.7K  [R0402]  157.38,73.76 90 top
R67  120R  [R0402]  121.25,58.6 90 top
R68  33R  [R0402]  105.75,45.25 90 top
R69  33R  [R0402]  108.25,45.25 90 top
R70  4.7K  [R0402]  103,57.25 90 top
R71  4.7K  [R0402]  109.35,53.05 0 top
R72  0R  [R0402]  55.5,66.1 180 top
R73  33R  [R0402]  47.9,75 0 top
R74  33R  [R0402]  47.9,76.6 0 top
R75  33R  [R0402]  39.4,38.6 270 top
R76  33R  [R0402]  52.3,58.2 0 top
R77  33R  [R0402]  33.3,38.4 270 top
R78  33R  [R0402]  95.7,24.3 180 top
R79  33R  [R0402]  95.7,25.5 180 top
R80  33R  [R0402]  95.7,37.9 180 top
R81  33R  [R0402]  95.7,26.8 180 top
R82  33R  [R0402]  95.7,28.6 180 top
R83  0R  [R0402]  100.97,96.2 270 top
R84  0R  [R0402]  121.28,96.2 270 top
R85  0R  [R0402]  141.6,95.57 270 top
R86  33R  [R0402]  95.7,33.8 180 top
R87  33R  [R0402]  95.7,35.4 180 top
R88  10K  [R0402]  30.2,28.4 0 top
R89  10K  [R0402]  27.68,28.43 180 top
R90  10K  [R0402]  33.43,31.96 270 top
RESET_XIO  1825910-6  [TACTILE-PTH]  164,84.73 180 top
RESET_XLX  1825910-6  [TACTILE-PTH]  164,71.09 180 top
SD_SLOT  5025700893  [5025700893]  8.4,82.92 90 top
SDRAM  IS42S32800J  [SOP50P1176X120-86]  29.46,88.44 270 top
SERIAL0  [DB9]  15.88,9.84 180 top
SERIAL_BUF0  MAX3232CDR  [SO16]  20.03,27.96 180 top
SLOT0  PCIE_64  [PCI-E_64]  69.22,81.92 270 top
SLOT1  PCIE_64  [PCI-E_64]  89.53,81.92 270 top
SLOT2  PCIE_64  [PCI-E_64]  109.86,81.92 270 top
SLOT3  PCIE_64  [PCI-E_64]  130.18,81.92 270 top
SLOT4  PCIE_64  [PCI-E_64]  150.5,81.92 270 top
TP1  [TESTPOINT_ROUND_0.5MM]  56.94,67.9 0 top
TP2  [TESTPOINT_ROUND_0.5MM]  56.94,69.16 0 top
TP3  [TESTPOINT_ROUND_0.5MM]  49.94,73.82 0 top
TP4  [TESTPOINT_ROUND_0.5MM]  44.34,81.48 0 top
TP5  [TESTPOINT_ROUND_0.5MM]  12.94,53.14 0 top
TP6  [TESTPOINT_ROUND_0.5MM]  57.34,47.2 0 top
TP7  [TESTPOINT_ROUND_0.5MM]  57.36,48.44 0 top
TP8  [TESTPOINT_ROUND_0.5MM]  57.36,49.7 0 top
TP9  [TESTPOINT_ROUND_0.5MM]  57.36,43.36 0 top
TP10  [TESTPOINT_ROUND_0.5MM]  57.36,44.82 0 top
TP11  [TESTPOINT_ROUND_0.5MM]  55.16,54.88 0 top
TP12  [TESTPOINT_ROUND_0.5MM]  55.16,53.54 0 top
TP13  [TESTPOINT_ROUND_0.5MM]  31.96,39.8 0 top
USB_ESD  PUSB2X4YH  [SOT363]  13.97,35.84 270 top
V33_0  AP7363-33D-13  [TO252-3L]  60.33,91.76 0 top
V33_1  AP7363-33D-13  [TO252-3L]  80.64,91.6 0 top
V33_2  AP7363-33D-13  [TO252-3L]  100.97,91.6 0 top
V33_3  AP7363-33D-13  [TO252-3L]  121.28,91.6 0 top
V33_4  AP7363-33D-13  [TO252-3L]  141.6,90.96 0 top
VGA  ICD15S13E4GX00LF  [DB15]  47.53,6.67 180 top
VGA_BLU  SN74ALVC244PWR  [TSSOP20]  44.32,27.28 0 top
VGA_GRN  SN74ALVC244PWR  [TSSOP20]  52.1,27.28 0 top
VGA_RED  SN74ALVC244PWR  [TSSOP20]  59.88,27.28 0 top
VREG1_2  LD1117  [SOT223]  121.5,52.75 180 top
VREG33  AP7363-33D-13  [TO252-3L]  87.33,4.94 180 top
VREG_MON  TPS3808G33DBVR  [SOT23-6]  161.3,79.44 0 top
X1  MINI-USB-UX60-MB-5ST  [UX60-MB-5ST]  6.4,29 0 top
XIO  STM32F429B-XIO  [PQFP208]  34.16,57 180 top
XIO-SWD  FTSH-105-01-LM-DV-K  [SWD_DEBUG]  29.02,32.8 180 top
XLX-  6SLX9TQG144  [TQ144]  113.5,30 180 top
Y2  NX3225SA-12.000MHZ-STD-CSR-1  [CRYSTAL_3.2X2.5]  56.52,60.65 180 top

## Tracks (layer width: path | path; a pad name or v marks a point on that pad's centre or on a via)
1.2V  (via drill 0.3)
  Top 0.152: 121.5,58 122.5,58 C93.1 122.62,58 123.25,57.38 v123.5,57.38 | 121.5,58 121.25,58 R67.1 121.5,58 | 121.5,58 121.5,56 VREG1_2.2 | v123.88,50.5 123,49.62 121.5,49.62 VREG1_2.4 | 113.25,16.75 113.38,16.88 113.45,16.94 | 114.25,30.25 114.25,19 XLX-.P128 | 119,30.25 124.5,30.25 XLX-.P19 | 119,30.25 114.75,30.25 | 114.75,30.25 114.25,30.25 | 119,30.25 123.5,34.75 124.5,34.75 XLX-.P28 | 114.25,30.25 113.75,30.75 102.5,30.75 XLX-.P89 | 114.75,30.25 114.75,41 XLX-.P52 | v126.25,35.38 126.25,34.88 126.25,34.75
  Top 0.203: XLX-.P128 114.25,17.75 113.45,16.94 | 113.25,16.75 C74.1
  Top 0.254: XLX-.P89 101.35,30.75 100.7,31.4 C36.1 | XLX-.P52 114.75,42.35 114.83,42.42 116.25,43.85 C73.1 | XLX-.P28 126.25,34.75 C75.1
  Bottom 0.152: v123.5,57.38 123.88,57 v123.88,50.5 126.5,47.88 126.5,35.62 v126.25,35.38
!MR!
  Top 0.152: RESET_XIO.1 167.38,82.38 165.12,80.12 C136.1 165,80.12 162.75,82.38 160.75,82.38 RESET_XIO.2 160.62,82.38 158.88,82.38 158.88,80.62 159.62,79.88 162.12,79.88 162.12,78.38 VREG_MON.3
!RESET!  (via drill 0.3)
  Top 0.152: 27.12,30.25 27.12,28.5 R89.2 | 27.12,30.25 26.5,30.25 XIO-SWD.P10 | 27.12,30.25 27.12,32.12 28.12,33.12 33.62,33.12 C98.1 34.75,34.25 v37.88,34.25 | v57.25,98 58.75,99.5 155.25,99.5 155.25,83.38 160.25,78.38 VREG_MON.1 | v50.88,61.12 50.5,60.75 49.5,60.75 XIO.34 49.38,60.75 48.75,60.75 48.62,60.62 40.5,60.62 v40.25,60.88
  Bottom 0.152: v57.25,98 50.88,91.62 v50.88,61.12 | v37.88,34.25 38.38,34.75 38.38,59 v40.25,60.88
!SDRAM_CAS!  (via drill 0.3)
  Top 0.152: v37.75,40.62 38.38,40.62 38.38,41.62 XIO.191 | v38,67.12 39,68.12 v43.12,68.12 | v32.12,92.88 32,93 31.75,93 31.5,93.25 31.5,94 SDRAM.18
  Route3 0.152: v43.12,68.12 43.12,69.38 40.75,71.75 40.75,85.62 33.75,92.62 33.75,93 33.25,93.5 32.75,93.5 v32.12,92.88
  Bottom 0.152: v37.75,40.62 38,40.88 v38,67.12
!SDRAM_RAS!  (via drill 0.3)
  Top 0.152: v38.25,73.5 38.38,73.5 38.38,72.38 XIO.70 | v38.25,89.62 36.38,91.5 32.25,91.5 31,92.75 31,94 SDRAM.19
  Bottom 0.152: v38.25,89.62 v38.25,73.5
!SDRAM_WE!  (via drill 0.3)
  Top 0.152: v46.38,71.25 47,71.25 47.25,71.5 51.88,71.5 52.25,71.12 57.5,71.12 57.5,69 57.12,68.62 51.62,68.62 51.25,68.25 49.5,68.25 XIO.49 | v31.88,98.38 31.88,94.12 SDRAM.17
  Bottom 0.152: v46.38,71.25 45.88,71.75 45.88,83.12 39.62,89.38 39.62,95.62 37,98.25 31.88,98.25 v31.88,98.38
+3V3  (via drill 0.3)
  Top 0.254: C22.1 22.8,95.73 22.8,95.67 22.88,95.62 v22.86,95.61 22.96,95.5 SDRAM.35 | C23.1 26,95.62 | 26,95.62 v26,95.61 | C19.1 19.75,96.6 | 19.75,96.6 19.82,96.6 | v12.8,90.83 12.8,91.74 12.75,91.75 R3.1 | v14.94,90.83 14.94,91.73 15,91.75 R2.1 | v10.57,90.83 10.57,91.75 10.62,91.75 R4.1 | SDRAM.41 19.96,95.55 v19.91,95.61 19.88,95.62 19.84,95.62 | SDRAM.29 25.96,95.56 v26.01,95.61 26,95.62 | C172.1 21.53,81.25 | 21.53,81.25 21.53,81.27 | SDRAM.49 21.46,81.35 v21.54,81.28 21.62,81.25 21.53,81.25 | C170.1 24.39,81.25 | 24.39,81.25 v24.39,81.28 | SDRAM.55 24.46,81.36 v24.38,81.28 24.5,81.25 24.39,81.25 | C28.1 21.63,73.78 v21.84,73.56 21.96,73.44 21.91,73.38 XIO.103 | C27.1 26.39,73.58 v26.42,73.56 26.46,73.51 26.41,73.45 XIO.94 | v3.56,74.47 3.56,73.5 | 3.56,73.5 C134.2 | R38.2 v5.89,74.47 | R39.2 7.8,74.38 | 7.8,74.38 7.8,74.45 | 9.71,74.42 v9.75,74.47 9.75,74.38 9.75,73.5 R40.2 | 11.58,73.42 11.58,73.5 | 11.58,73.5 v11.58,74.47 | R37.2 13.51,73.5 | 13.51,73.5 v13.51,74.47 | R41.2 15.42,74.38 | 15.42,74.38 15.42,74.45 | C29.1 17.61,64.89 v17.68,64.82 17.75,64.75 XIO.115 | C8.1 17.55,60.12 v17.68,60.25 | v17.69,60.26 v17.68,60.25 | C32.1 17.5,54.21 | 17.5,54.21 17.54,54.21 | 17.14,46.1 17.15,46.1 17.19,46.15 | 17.19,46.15 v17.68,46.63 17.68,46.78 18.15,47.25 XIO.150 | 21.95,40.12 C16.1 22,38.88 22.12,38.88 23.25,37.75 25.25,37.75 25.25,29.12 27.12,27.25 27.19,27.19 | 21.95,40.12 21.95,40.13 | 28.35,38.99 28.35,39 | 28.35,39 v28.35,40.13 | 28.46,40.25 28.46,40.24 v28.35,40.13 | Q1.1 35.26,21.4 v35.26,20.32 | Q2.1 38.81,21.34 v38.81,20.32 | v41.55,31.39 42.38,32.23 42.5,32.25 42.75,32.25 D3.2 | VGA_BLU.20 41.4,31.23 v41.55,31.39
  Top 0.254: VGA_GRN.20 49.17,31.09 v49.38,31.29 50.31,32.23 50.38,32.25 D4.2 | VGA_RED.20 56.95,31.05 v57.2,31.29 58.12,32.21 58.13,32.23 58.25,32.25 58.38,32.25 D5.2 | 55.9,41.8 55.88,41.8 | 55.88,41.8 R53.1 | R5.1 55.8,39.6 55.88,39.62 56.25,40 57.25,40 | 52,56.69 C4.1 52,56.75 52,56.69 | 52,56.69 v50.9,56.69 | 50.83,56.76 v50.9,56.69 | C33.1 51.06,51.67 v50.9,51.51 50.64,51.25 XIO.15 | 50.88,46.76 v51,46.63 | C31.1 51.12,46.59 | 51.12,46.59 51.05,46.59 | v51.71,70.92 51.71,70.34 51.75,70.25 51.88,70.25 52,70.12 C5.1 51.76,69.75 XIO.52 | R56.1 87.41,13.46 v87.41,14.2 | C57.1 140.65,53.66 140.62,53.66 | 140.62,53.66 140.53,53.66 | LVL_AHI.1 140.27,51.58 v140,51.31 140.39,50.92 LVL_AHI.2 | C63.1 138.13,41.4 v138.07,41.45 | v143.46,42.06 143.4,42 LVL_RD4.6 143.38,41.12 143.38,40.5 LVL_RD4.5 | C62.1 149.91,41.4 v149.96,41.35 | v144.58,38.91 144.6,38.94 LVL_RD5.6 144.62,39.88 144.62,40.5 LVL_RD5.5 | LVL_ALO.2 140.32,33.92 v140,34.24 140.34,34.58 LVL_ALO.1 | v138.79,23.88 139.78,23.88 139.88,23.88 C65.1 | 142.12,23.77 | 142.12,23.77 v142.85,23.77 | v143.15,22.55 143.6,23 LVL_RW.5 | v146,23.57 145.43,23 LVL_CLK.5 | v146.2,22.25 146.25,22.25 | 146.25,22.25 LVL_CLK.1 | C61.1 141.4,18.46 v141.12,18.19 141.12,17.62 | 141.12,17.61 141.12,17.62 | v107.8,16.15 107.85,16.1 C78.1 C76.1 110,16.12 110.05,16.15 111.25,16.15 | 127.24,22.66 127.16,22.66 | 127.16,22.66 v126.19,22.66 126.09,22.75 XLX-.P4 | XLX-.P20 126.22,30.75 v126.29,30.68 127.22,30.68 127.25,30.62 127.38,30.5 C49.1 | XLX-.P18 126.21,29.75 v126.29,29.67 127.23,29.67 127.25,29.62 127.38,29.62 C52.1 C87.1 | XLX-.P36 122.9,38.75 v122.83,38.81 | XLX-.P31 122.86,36.25 v122.83,36.27
  Top 0.254: 127.4,40.01 C50.1 C48.1 C86.1 | 127.4,40.01 v127.4,40.12 v127.4,40.13 | XLX-.P69 106.25,42.75 v106.78,43.28 106.78,44.61 | 106.78,44.61 106.78,44.62 | XLX-.P63 109.25,43.21 v109.32,43.28 109.25,43.35 C84.1 | C51.1 114.33,43.31 v114.3,43.28 114.25,43.23 XLX-.P53 | XLX-.P42 119.75,43.18 | 119.75,43.18 119.75,43.24 | C83.1 119.75,43.32 v119.79,43.28 119.75,43.25 119.75,43.18 | v123.95,45.92 123.03,45.92 123,45.88 R60.2 | A_MUX.18 104.33,53.93 v104.19,53.8 | 105.62,53.89 v105.72,53.8 105.62,53.89 | C97.1 108.14,51.85 v107.7,51.41 108.36,50.75 C96.1 | 104.95,49.1 104.95,49.12 104.95,49.21 | 104.95,49.21 v104.95,50.29 | v117.96,55.07 119.38,55.07 | 119.2,55.25 119.2,55.78 | 119.2,55.78 VREG1_2.3 | v117.96,55.78 119.2,55.78 | v117.96,56.49 118.97,56.49 119.2,56.26 | 119.08,56.59 v119.08,57.81 119.81,57.81 119.88,57.88 C95.1 | C25.1 87.12,55.12 87.16,55.17 87.25,55.12 v87.38,55.17 88.27,55.17 88.29,55.17 88.38,55.12 88.38,54.5 FPGA_CFG.8 | v93.98,55.47 94.02,55.43 R52.1 | R54.2 85.62,51.23 v85.45,51.41 | SDRAM.43 18.96,95.06 19.52,95.62 19.84,95.62 | 19.84,95.62 19.88,95.62 v19.9,95.62 19.9,96.52 19.88,96.62 C21.1 19.75,96.62 19.75,96.6 | SDRAM.15 32.97,95.46 v32.82,95.61 32.88,95.62 32.8,95.62 | C169.1 32.8,95.62 | 32.8,95.62 | SDRAM.9 35.97,95.5 v35.87,95.61 35.87,96.52 | 35.87,96.53 35.87,96.52 | SDRAM.3 38.97,95.45 v38.81,95.61 38.65,95.77 C20.1 | SDRAM.1 39.97,95.34 v40.23,95.61 40.25,95.62 | 40.25,95.62 C167.1 40.25,96.62 C167.1 C168.1 | 40.25,95.62 | SDRAM.67 30.46,84.21 v30.48,84.23 | SDRAM.75 34.47,81.5 34.47,81.44 | 34.47,81.44 34.47,81.4 | C171.1 34.48,81.34 v34.44,81.38 34.5,81.5 34.47,81.44
  Top 0.254: SDRAM.81 37.47,81.51 v37.59,81.38 37.66,81.31 C177.1 | C7.1 31.83,73.63 v31.9,73.56 31.96,73.5 31.91,73.44 XIO.83 | C6.1 36.91,73.69 v36.88,73.66 36.91,73.63 XIO.73 | v54.36,64.62 54.34,64.63 R21.2 53.5,64.62 52.88,64 52.5,64 52.5,63.38 C34.1 52.35,63.25 XIO.39 | C3.1 35.6,40.2 v35.56,40.23 35.41,40.38 XIO.185 | C82.1 100.6,37 v100.79,37.19 100.85,37.25 XLX-.P76 | C80.1 100.6,32.5 v100.79,32.31 100.85,32.25 XLX-.P86 | XLX-.P90 100.88,30.25 | 100.88,30.25 100.81,30.25 | C59.1 C58.1 100.74,30.33 v100.79,30.28 100.88,30.25 | C79.1 100.61,23.5 v100.69,23.57 100.86,23.75 XLX-.P103 | VREG_MON.5 VREG_MON.6 159.67,80.58 v159.51,80.75 | 166.58,80.06 166.62,80.06 166.62,80.12 C137.1 167.2,80.03 v167.41,80.25 | XIO.124 17.78,60.25 17.75,60.25 | 17.75,60.25 17.7,60.25 | XIO.59 43.91,73.5 | 43.91,73.5 43.91,73.55 | C26.1 v43.9,73.57 v43.89,73.56 44,73.5 43.91,73.5 | XIO.26 50.75,56.75 | 50.75,56.75 50.8,56.75 50.83,56.75 | 50.8,46.75 XIO.6 49.38,46.75 48.5,46.75 v47.38,45.62 | 50.8,46.75 50.87,46.75 | XIO.158 21.91,40.27 v21.95,40.23 22,40.12 21.95,40.12 | XIO.171 28.41,40.32 | 28.41,40.32 28.41,40.29 | XLX-.P129 114.75,17.5 | 114.75,17.5 114.75,17.46 | 114.75,17.46 114.75,17.42 | C47.1 114.33,16.99 114.33,17 114.38,17 v114.53,17.2 | v114.53,17.2 114.75,17.42 114.75,17.5 | 114.33,17 v114.53,17.2 | XLX-.P135 117.75,17.68 v117.95,17.47 | XLX-.P122 111.25,17.46 v111.25,17.38 v111.25,17.37 | C77.1 111.25,16.12 111.25,16.15 | 111.25,16.15 v111.25,17.37 | XLX-.P125 112.75,20.57 v112.85,20.67 | 105.62,53.89 A_MUX.16 | SD_SLOT.P$4 3.02,83.52 3,83.52 | 3,83.52 v2.95,83.52 | v106.1,12.75 106.84,12.75 106.92,12.75 107,12.75 C35.1 108.27,12.78
  Top 0.254: 108.27,12.78 108.29,12.78 | XIO.137 18.08,53.75 v17.58,54.25 17.5,54.25 17.5,54.21 | 24.52,22.12 | 24.52,22.12 24.52,23.24 24.52,24.79 24.5,24.88 SERIAL_BUF0.16 24.62,24.88 24.88,24.88 27.19,27.19 | 157.31,74.33 157.31,74.38 | 157.31,74.38 v157.31,75.25 | R88.1 29.62,28.38 28.25,28.38 R89.1 28.25,28.25 27.19,27.19 | R12.1 17,21.5 18,21.5 R11.1 18.12,21.5 18.25,21.38 23.88,21.38 24.5,22 C94.2 24.5,22.12 24.52,22.12 | 47.25,40.75 45.12,40.75 44.88,41 44.88,41.62 XIO.204 | 47.25,40.75 47.88,40.75 48.12,40.5 C2.1 | 57.25,40 58.75,40 59.12,40.38 59.12,41.75 56,41.75 55.88,41.8 | LVL_RW.1 142.12,23.75 142.12,23.77 | 146.25,22.25 v146.2,22.25 | R36.2 11.62,73.5 11.58,73.5 | R37.2 13.5,73.5 13.51,73.5 | R90.1 33.5,32.5 40.25,32.5 41.38,31.38 v41.55,31.39 | R57.2 89.5,46.75 89.5,46.64 v90.22,45.92 R55.2 91,46.75 R55.2 | R66.2 157.38,74.38 157.31,74.38 | 7.8,74.38 7.88,74.38 v7.82,74.47 | 15.42,74.38 15.5,74.38 v15.44,74.47 | C9.1 16.75,46.12 17.12,46.12 17.19,46.15 | 28.35,39 28.38,39 C10.1 28.38,38.88 29,38.88 29,38.25 30,37.25 31.5,37.25 31.5,35.38 XIO-SWD.P1 | C134.2 3.62,73.5 3.56,73.5 | C24.1 35.88,96.62 35.87,96.52 | C88.1 127.38,22.5 127.25,22.62 127.16,22.66 | C85.1 106.75,44.62 106.78,44.61 | C64.1 149.25,23.88 150.12,23.88 v150.16,23.88 | C60.1 141.88,36.25 141,36.25 v140.92,36.17 | A_MUX.8 105,49.12 104.95,49.21 | LVL_D.1 141.12,17.62 | 140.62,53.66 140.62,53.62 v140.51,53.65 | 51.12,46.59 51.12,46.62 v51,46.63 | 17.75,60.25 v17.68,60.25 | 50.75,56.75 v50.9,56.69 | OSC1.4 108.5,12.5 108.25,12.75 108.27,12.78 | 50.8,46.75 50.88,46.75 v51,46.63 | 28.41,40.32 28.5,40.38 v28.35,40.13 | 3,83.52 3,83.5 v2.95,83.52
  Top 0.254: 127.4,40.01 127.38,40.12 v127.41,40.13 | 114.75,17.5 114.75,17.46 | v57.25,39.88 57.25,40 | v47.25,40.62 47.25,40.75
  Bottom 0.254: v57.25,39.88 57.25,31.38 v57.2,31.29 | v47.25,40.62 47.38,40.75 v47.38,45.62
  pour Route15: -1.91,102.23 44.86,102.31 171.72,102.31 171.72,-1.27 -1.91,-1.27
+5V  (via drill 0.3)
  Top 0.152: SLOT4.B3 149.5,92 149.5,93.88 SLOT4.B1 | 139.34,88.7 139.38,88.88 139.38,89.38 V33_4.P$1 | 139.75,91.95 139.75,91.75 139.75,91.38 V33_4.P$1 | 139.62,89.51 139.62,89.5 V33_4.P$1 | 140,91.14 140,91.25 V33_4.P$1 | 140.49,90.32 140.5,90.25 V33_4.P$1 | 142.5,89.51 142.5,89.5 V33_4.P$1 | 141.78,91.14 141.62,91 V33_4.P$1 | 144.07,92.76 144.12,92.62 144.12,91.38 V33_4.P$1 | 142,90.32 142,90.38 V33_4.P$1 | 142.16,89.79 142.25,89.88 V33_4.P$1 | 140.97,90.07 140.88,90.12 V33_4.P$1 | SLOT4.B2 147.38,92.88 145.75,91.25 145.38,91.25 145.19,91.14 | 121.5,91.44 121.5,91.5 V33_3.P$1 | V33_3.P$1 123.38,92.25 123.51,92.42 | 118.69,89 118.75,89.25 118.75,89.62 118.75,89.81 | 119.5,89.81 119.75,89.88 119.75,90 119.98,90.13 120,90.38 120,90.63 | 120.31,90.63 120.5,90.62 120.56,90.87 | 119.5,92.25 119.5,92 119.5,91.62 119.5,91.44 | 121.41,90.63 121.25,90.75 121,91 120.86,91.18 121,91.38 121.12,91.38 V33_3.P$1 | 122.22,89.81 122.25,90 122.25,90.38 122.25,90.63 | 129.25,93 129.25,93.88 SLOT3.B1 129.12,93.88 128.12,93.88 127.25,93 SLOT3.B2 127.12,92.88 125.5,92.88 125,92.38 124.87,92.25 | 129.25,93 129.25,92 SLOT3.B3 | 108.88,93 108.88,93.88 SLOT2.B1 | 108.88,93 108.88,92.88 | 108.88,92.88 108.88,92 SLOT2.B3 | 100.62,92.12 100.57,92.07 | 100.62,92.12 V33_2.P$1 | V33_2.P$1 100.88,91.62 100.62,91.54 | V33_2.P$1 100.25,90.88 100.1,90.73 | 100.62,92.12 V33_2.P$1 | 100.62,92.12 100.5,92.35 | V33_2.P$1 100.25,92.38 100.08,92.35 | V33_2.P$1 103,92.38 103.19,92.49 | 99.12,89.92 99.12,89.88 V33_2.P$1 | 101.88,90.73 101.88,90.5 101.88,90.12 V33_2.P$1 | 99.06,89.69 99.12,89.75 V33_2.P$1 | 101.5,91.54 101.25,91.62 V33_2.P$1
  Top 0.152: 100.12,89.92 100.12,89.88 V33_2.P$1 | 100.33,89.69 100.38,89.75 V33_2.P$1 | 104.44,91.54 104.62,91.62 105.88,92.88 106.75,92.88 SLOT2.B2 106.88,93 108.88,93 | 88.62,93 88.62,93.88 SLOT1.B1 | 88.62,93 88.62,92.88 | 88.62,92.88 88.62,92 SLOT1.B3 | 83,92.38 83,92.35 | 83,92.38 V33_1.P$1 | 78.62,89.92 78.62,89.88 V33_1.P$1 | 79.5,90.73 79.5,90.75 V33_1.P$1 | 78.62,91.75 78.62,92.12 78.62,92.35 | 78.62,91.75 V33_1.P$1 | 78.62,91.75 78.62,91.54 | 78.62,91.75 V33_1.P$1 | 80.75,91.54 80.75,91.5 V33_1.P$1 | 80.27,91.23 80.12,91.12 V33_1.P$1 | 83,92.38 82.9,92.38 | 83,92.38 V33_1.P$1 | V33_1.P$1 81.25,90.5 81.28,90.32 | 84.23,92.35 84.38,92.5 84.75,92.88 86.5,92.88 SLOT1.B2 86.62,93 88.62,93 | 68.25,93 68.25,93.88 SLOT0.B1 | 68.25,93 68.25,92.88 | 68.25,92.88 68.25,92 SLOT0.B3 | 68.25,93 66.25,93 SLOT0.B2 66.12,92.88 65.88,92.62 64.12,92.62 63.91,92.56 | 60.33,91.5 60.38,91.5 V33_0.P$1 | 58.38,89.5 58.38,89.88 58.38,90.12 | 58.38,89.5 V33_0.P$1 | 58.38,89.5 58.38,89.31 | 58.38,89.5 V33_0.P$1 | 59.38,90.93 59.38,91 V33_0.P$1 | 58.5,92.56 58.5,92.38 58.5,91.88 V33_0.P$1 | 62.5,92.56 62.5,92.62 V33_0.P$1 | 60.48,90.93 60.5,91 V33_0.P$1 | 60.48,91.75 60.5,91.75 V33_0.P$1 | 60.15,90.12 60,90.12 V33_0.P$1 | 59.85,89.31 59.88,89.38 V33_0.P$1 | 60,91.5 V33_0.P$1 | 62.75,92.71 62.75,92.75 V33_0.P$1 | 59.69,89.06 59.75,89.12 V33_0.P$1 | 68.25,92.88 71.12,92.88 72,92 76.62,92 76.88,91.75 77.01,91.54 | 88.62,92.88 91.38,92.88 92.25,92 97,92 97.25,92.25 97.43,92.35 | 108.88,92.88 111.75,92.88 112.62,92 117.38,92 117.5,92.12 117.65,92.25 | 129.25,93 132.38,93 133.25,93.88 136.25,93.88 138,92.12 138.18,91.95 | v147.75,36.12 146.75,36.12 C67.1
  Top 0.152: LVL_ALO.23 147,34 147,34.5 LVL_ALO.24 147,34.62 147.62,34.62 v147.88,34.88 148.5,34.25 161.12,34.25 162,33.38 162,13.88 161.62,13.88 PJ-102AH.TIP 161.5,13.88 156.38,19 149.12,19 | 148.38,39 146.5,39 146.5,39.75 LVL_RD5.1 146.38,39.75 145.88,39.75 145.88,41.38 144.62,42.62 | 148.38,39 148.88,39.5 C70.1 | 142.38,42 143,42.62 144.62,42.62 | 142.38,42 141.62,41.25 LVL_RD4.1 | 142.38,42 137.5,42 137.5,41.12 139,39.62 C69.1 | v148.5,38.12 148.5,39 148.38,39 | 150.25,52.38 150.25,51.5 147,51.5 | 150.25,52.38 150.25,52.5 149.62,53.12 147.25,53.12 146.75,53.62 C66.1 | 147,51.5 LVL_AHI.24 147,51.5 | 147,51.5 147,51 LVL_AHI.23 146.88,50.88 144.62,50.88 144.62,42.62 | 150.25,52.38 157.25,52.38 158.25,53.38 160.62,53.38 CARTRIDGE.P13 | C173.1 13,26.12 12.5,25.62 12,25.62 11.38,25 PSW.1 11.38,24.88 11.62,24.62 11.88,24.62 12.88,23.62 12.88,20.12 33.25,20.12 33.75,20.62 33.88,20.62 34.12,20.88 34.12,23.38 R50.1 34.25,23.5 36.62,23.5 | 36.62,23.5 37.5,23.5 R51.1 37.62,23.38 37.75,23.25 v38.5,23.25 | D2.2 32.88,29.62 33.75,30.5 35.75,30.5 36.62,29.62 D1.2 36.62,29.5 36.62,23.5 | 87.88,5.12 87.88,5.25 87.74,5.36 | 87.88,5.12 VREG33.P$1 | 89.62,6.58 89.62,6.38 89.62,6 VREG33.P$1 | 86,5.77 86,6 86,6.38 VREG33.P$1 | 89,5.77 89,5.75 VREG33.P$1 | 86.19,7.39 86.25,7.25 86.25,6.75 VREG33.P$1 | 88.62,4.14 88.62,4.38 88.62,4.75 VREG33.P$1 | 87.88,5.12 88.01,4.96 | 87.88,5.12 VREG33.P$1 | 86.9,4.96 87.12,5 87.12,5.12 VREG33.P$1 | 86.38,4.14 86.38,4.38 86.38,4.75 VREG33.P$1 | 86.38,6.58 86.38,6.62 VREG33.P$1 | 88.38,6.74 88.38,6.75 VREG33.P$1 | 88.32,7.12 88.5,7.12 VREG33.P$1 | 144.75,22.25 145,22.25 LVL_CLK.6
  Top 0.152: 144.75,22.25 144.5,22.25 144.5,23.25 144,23.75 LVL_RW.6 | 144.75,22.25 144.25,21.75 | 144.25,21.75 143.62,21.12 140.75,21.12 139.88,22 C72.1 | C68.1 146.88,19 146.88,17.62 LVL_D.24 147,17.5 147,17 LVL_D.23 146.88,16.88 145.12,16.88 145.12,12.75 137.38,5 91.12,5 90.96,4.96 | 149.12,19 149.12,22 C71.1 | 147,19 149.12,19 | 147,19 C68.1 | 147,19 144.25,21.75 | 147,19 C68.1 | v80,14.25 80.38,13.88 82.5,13.88 83.75,12.62 83.75,7.62 83.85,7.39
  Top 0.508: 138.18,88.7 138.75,88.7 139.06,88.7 139.22,88.7 139.34,88.7 | 138.18,89.51 138.75,89.51 139.38,89.51 139.54,89.51 139.62,89.51 140.15,89.51 | 138.18,90.32 140.49,90.32 140.72,90.32 | 138.18,91.14 140,91.14 140.02,91.14 140.12,91.14 140.61,91.14 | 138.18,91.95 139,91.95 139.38,91.95 139.54,91.95 139.75,91.95 139.8,91.95 | 145.19,91.14 141.78,91.14 | 145.19,90.32 142.12,90.32 142.08,90.32 142,90.32 141.63,90.32 | 145.19,89.51 142.75,89.51 142.56,89.51 142.5,89.51 142.44,89.51 | 145.19,88.7 143.26,88.7 142.6,89.35 142.33,89.62 142.25,89.7 142.16,89.79 141.99,89.97 | C81.1 144.07,92.76 | C45.1 140.97,89.5 140.97,90.07 | 117.65,89 118.25,89 118.43,89 118.59,89 118.62,89 118.69,89 | 120.56,90.87 120.86,91.18 | 117.65,89.81 118.25,89.81 118.43,89.81 118.59,89.81 118.62,89.81 118.75,89.81 119.5,89.81 | 117.65,90.63 119.88,90.63 120,90.63 120.31,90.63 | 117.65,91.44 119.12,91.44 119.5,91.44 119.88,91.44 120.6,91.44 120.83,91.21 120.86,91.18 | 120.86,91.18 | 117.65,92.25 119.12,92.25 119.5,92.25 119.88,92.25 120.63,92.25 | 124.87,92.25 123.34,92.25 121.94,92.25 V33_3.P$1 | 124.87,91.44 121.5,91.44 121.31,91.44 | 124.87,90.63 122.25,90.63 122.08,90.63 121.41,90.63 | 124.87,89.81 122.22,89.81 123.04,89 124.87,89 | C43.1 120.65,89.46 119.98,90.13 119.93,90.18 119.9,90.21 | C56.1 123.51,92.42 | 97.43,89.1 98.47,89.1 99.06,89.69 99.12,89.75 99.3,89.93 99.38,90.01 | 100.29,90.92 V33_2.P$1 | 97.43,89.92 99,89.92 99.12,89.92 99.22,89.92 99.28,89.92 | 97.43,90.73 99.38,90.73 100.1,90.73 | 97.43,91.54 100.62,91.54 100.69,91.54 | 97.43,92.35 100.08,92.35 | 100.33,92.3 100.5,92.13 100.57,92.07 100.69,91.95
  Top 0.508: 103.33,92.35 103,92.35 100.5,92.35 100.49,92.35 100.38,92.35 | 104.44,91.54 101.6,91.54 101.5,91.54 | 104.44,90.73 103.12,90.73 102.39,90.73 102.08,90.73 101.88,90.73 101.7,90.73 | 104.44,89.92 101.91,89.92 | 101.91,89.92 100.38,89.92 100.12,89.92 99.77,89.92 | 104.44,89.1 102.72,89.1 101.91,89.92 | C55.1 103.19,92.49 | C41.1 100.33,89.69 100.33,89.86 | 77.01,89.1 78.15,89.1 79.21,90.16 79.56,90.52 | 79.56,90.52 79.82,90.77 | 77.01,89.92 78.62,89.92 78.74,89.92 78.9,89.92 79.05,89.92 | 77.01,90.73 79.5,90.73 79.78,90.73 | 77.01,91.54 78.62,91.54 78.75,91.54 78.9,91.54 79.22,91.54 79.25,91.54 79.96,91.54 | 77.01,92.35 78.5,92.35 78.62,92.35 78.75,92.35 78.9,92.35 79.22,92.35 79.89,92.35 | 84.23,92.35 83.12,92.35 83.03,92.35 83,92.35 82.91,92.35 | 81.4,92.35 V33_1.P$1 | 84.23,91.54 83,91.54 82.87,91.54 80.88,91.54 80.8,91.54 80.75,91.54 80.59,91.54 | 84.23,90.73 81.69,90.73 80.77,90.73 80.27,91.23 | 84.23,89.92 81.5,89.92 81.28,89.92 | 81.28,89.92 80.97,89.92 | 84.23,89.1 81.38,89.1 81.28,89.1 | 81.28,89.1 80.97,89.1 79.56,90.52 | C39.1 81.28,88.9 81.28,89.1 | 81.28,89.1 81.28,89.92 | 81.28,89.92 81.28,90.01 81.28,90.32 | C54.1 82.9,92.38 82.9,92.36 | 90.96,5.77 89.48,5.77 89.12,5.77 89,5.77 88.73,5.77 | 88.15,5.77 87.74,5.36 87.68,5.29 | 90.96,6.58 90.28,6.58 89.8,6.58 89.64,6.58 89.62,6.58 89.54,6.58 | 90.96,7.39 90.28,7.39 89.03,7.39 88.67,7.03 88.62,6.98 88.47,6.83 88.38,6.74 87.96,6.33 | 90.96,4.96 90.28,4.96 88.53,4.96 88.01,4.96 | 90.96,4.14 90.28,4.14 89.96,4.14 89.53,4.14 88.88,4.14 88.62,4.14 88.13,4.14 | 83.85,4.14 85.4,4.14 86.15,4.14 86.38,4.14 86.47,4.14 87,4.14
  Top 0.508: 83.85,4.96 86.65,4.96 86.78,4.96 86.9,4.96 | 83.85,5.77 84.9,5.77 85.51,5.77 85.67,5.77 85.88,5.77 86,5.77 86.08,5.77 | 83.85,6.58 85.4,6.58 85.83,6.58 86.15,6.58 86.25,6.58 86.38,6.58 87,6.58 | 83.85,7.39 85.03,7.39 85.67,7.39 85.99,7.39 86.12,7.39 86.19,7.39 | 56.69,92.56 58.12,92.56 58.38,92.56 58.5,92.56 58.58,92.56 58.9,92.56 59.52,92.56 | 56.69,91.75 60.25,91.75 60,91.5 59.88,91.37 59.66,91.15 59.59,91.08 | 56.69,90.93 58.58,90.93 59.38,90.93 59.44,90.93 | 56.69,90.12 57.62,90.12 58.26,90.12 58.38,90.12 58.5,90.12 58.58,90.12 58.62,90.12 | 56.69,89.31 57.62,89.31 58.38,89.31 58.5,89.31 58.93,89.31 | 60.33,91.03 60.33,91.38 60.33,91.5 60.33,91.6 60.33,91.64 | 63.91,89.31 59.88,89.31 59.85,89.31 59.84,89.31 | 63.91,90.12 60.15,90.12 | 63.91,90.93 60.5,90.93 60.48,90.93 60.43,90.93 | 63.91,91.75 60.5,91.75 60.48,91.75 60.43,91.75 | 63.91,92.56 62.69,92.56 62.5,92.56 60.66,92.56 | C53.1 62.75,92.75 62.75,92.71 62.75,92.62 | C37.1 59.69,89.06 59.69,89.12 59.69,90.07 59.89,90.27 | C11.1 88.65,13.92 88.55,13.82 88.32,13.59 88.32,7.2 88.32,7.12 88.32,6.99
  Bottom 0.152: SLOT4.B2 147.5,93 149.38,93 149.38,93.88 SLOT4.B1 149.5,94 151.12,95.62 158.88,95.62 158.88,55.25 160.62,53.5 CARTRIDGE.P13 | v147.88,34.88 147.88,36 v147.75,36.12 148.5,36.88 v148.5,38.12 | v38.5,23.25 40.88,20.88 40.88,17.88 42.25,16.5 42.25,15.5 41.5,14.75 41.5,13.75 42.25,13 56.5,13 56.5,17.38 56.75,17.62 80,17.62 v80,14.25
  pour Route14: -4.1,103.5 172.8,103.5 172.8,-4.1 -4.1,-4.1
AGND
  Top 0.152: R72.2 55,66 54.75,65.75 53.75,65.75 C1.2 53.62,65.75 53.62,66.5 C13.2
ARCH0
  Top 0.152: 10.12,57.75 10.12,59.5 10.5,59.5 ARCH_ID.1 | 10.12,57.75 10.12,56.62 R9.1 | 10.12,57.75 18.75,57.75 XIO.129
ARCH1
  Top 0.152: ARCH_ID.2 10.5,62 6.38,62 6.38,56.5 R8.1 6.38,56.38 6.88,55.88 10.5,55.88 12,57.38 14.38,57.38 14.5,57.25 18.75,57.25 XIO.130
ARCH2  (via drill 0.3)
  Top 0.152: R7.1 3.75,70.38 9.38,64.75 10.5,64.75 ARCH_ID.3 | v14.25,56.75 15.25,55.75 18.75,55.75 XIO.133
  Bottom 0.152: v14.25,56.75 12,59 12,63.25 10.62,64.62 ARCH_ID.3
ARCH3
  Top 0.152: R6.1 10.12,70.38 10.12,67.25 10.5,67.25 ARCH_ID.4 10.62,67.12 12,67.12 12,64.25 11.5,63.75 5.62,63.75 5.62,56.12 6.5,55.25 18.75,55.25 XIO.134
AUX_CTS  (via drill 0.3)
  Top 0.152: v21.5,69.75 18.88,69.75 XIO.105 | v62.25,14.25 62.62,13.88 78,13.88 AUX-SIO.2
  Bottom 0.152: v21.5,69.75 22.5,68.75 22.5,24.62 21.62,23.75 21.62,13.38 25.5,9.5 25.5,8.75 27.38,6.88 57.25,6.88 57.25,13 58.88,14.62 62.25,14.62 v62.25,14.25
AUX_RTS  (via drill 0.3)
  Top 0.152: v24.75,69.25 24.62,69.12 21.38,69.12 21.25,69.25 18.88,69.25 XIO.106 | v39.12,14.38 43,10.5 53.12,10.5 54.75,8.88 75.38,8.88 78,6.25 AUX-SIO.5
  Route3 0.152: v24.75,69.25 24.75,68.25 v34.5,58.5
  Bottom 0.152: v34.5,58.5 37.12,55.88 37.12,16.38 v39.12,14.38
AUX_RX  (via drill 0.3)
  Top 0.152: v23.5,69.88 27.88,69.88 27.88,72.25 XIO.91 | v54.75,9.62 54.75,14.62 61.12,14.62 64.38,11.38 78,11.38 AUX-SIO.3
  Bottom 0.152: v23.5,69.88 23.5,46.5 23.75,46.25 23.75,41.5 22.88,40.62 22.88,24.5 22,23.62 22,20.62 35.38,7.25 54.75,7.25 v54.75,9.62
AUX_TX  (via drill 0.3)
  Top 0.152: v31.25,70.5 28.38,70.5 28.38,72.25 XIO.90 | v33.5,16.38 33.75,16.62 v66.25,16.62
  Bottom 0.152: v31.25,70.5 33.5,68.25 v33.5,16.38 | v66.25,16.62 74.12,8.75 78,8.75 AUX-SIO.4
BOOT0  (via drill 0.3)
  Top 0.152: R5.2 R1.1 v52.5,40.7 | v41.4,40.4 XIO.197 41.38,41.75 XIO.197
  Route3 0.152: v52.5,40.7 52,40.7 51.1,39.8 42,39.8 v41.4,40.4
CBUS_!CCTL!